# EAGLE design Board 0 (EAGLE 9.3.2)
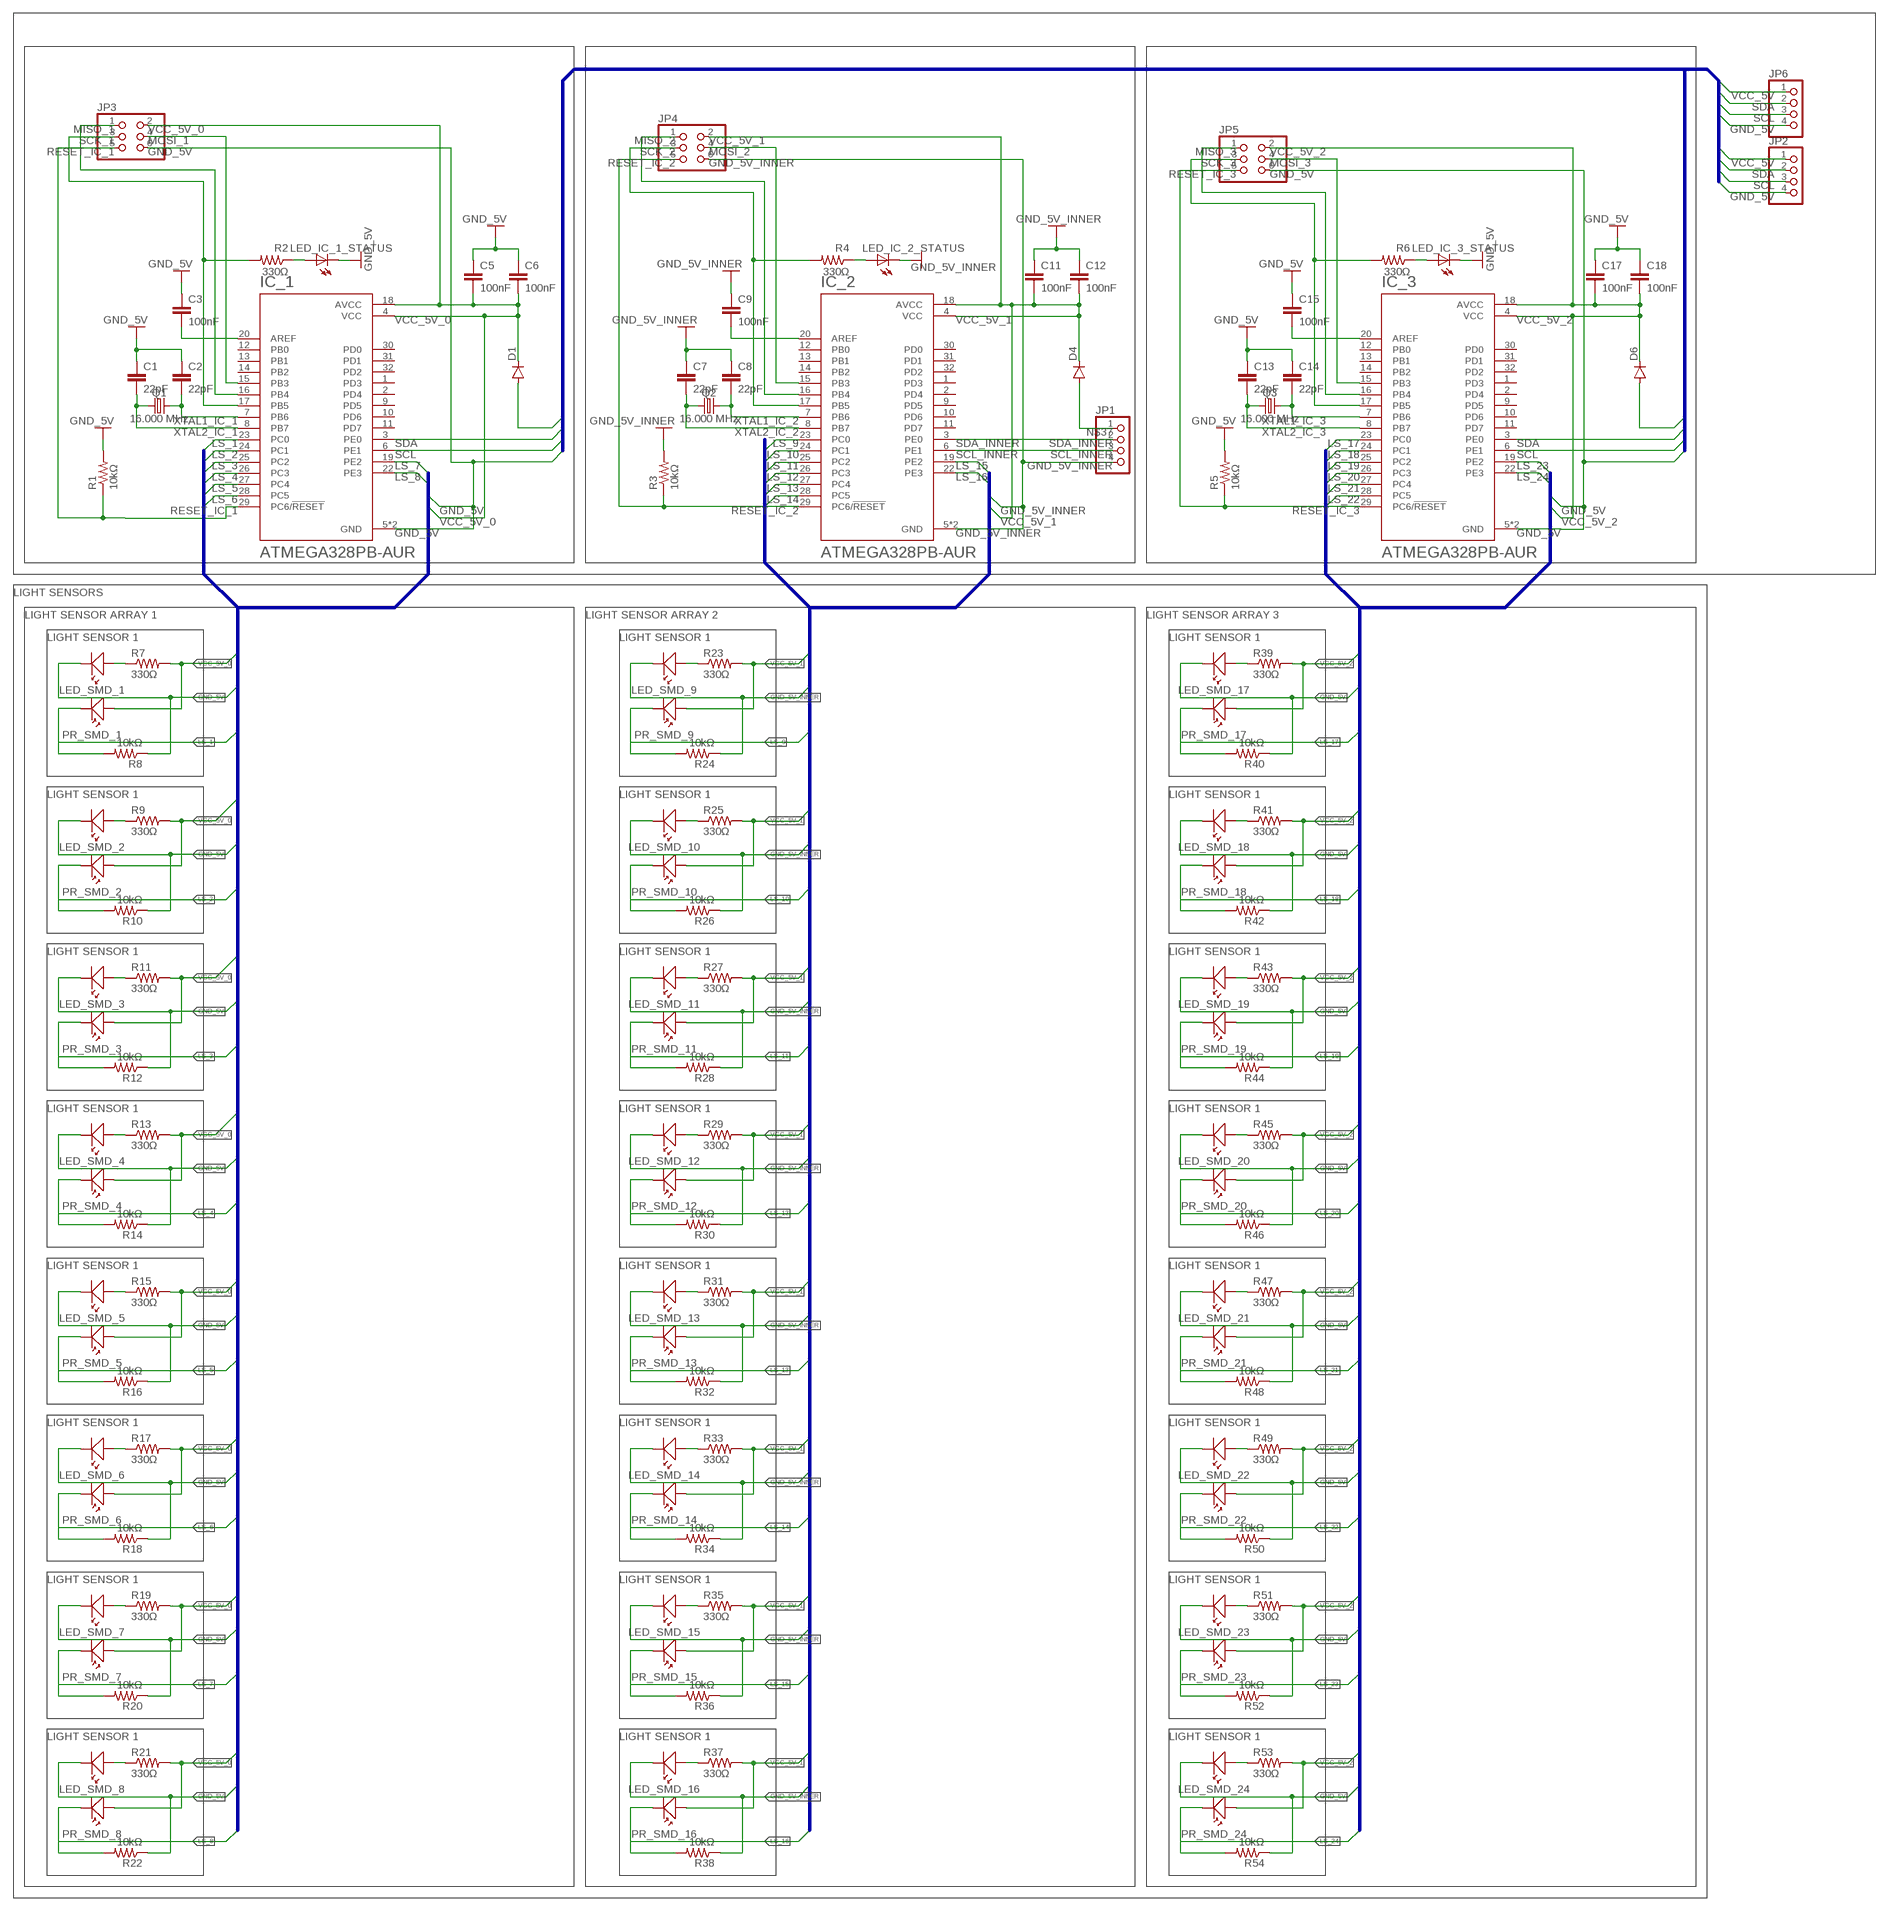
[diagram p0: schematic, sheet 1]

## Parts
C1  22pF  C-EUC1206  [C1206]
C2  22pF  C-EUC1206  [C1206]
C3  100nF  C-EUC1206  [C1206]
C5  100nF  C-EUC1206  [C1206]
C6  100nF  C-EUC1206  [C1206]
C7  22pF  C-EUC1206  [C1206]
C8  22pF  C-EUC1206  [C1206]
C9  100nF  C-EUC1206  [C1206]
C11  100nF  C-EUC1206  [C1206]
C12  100nF  C-EUC1206  [C1206]
C13  22pF  C-EUC1206  [C1206]
C14  22pF  C-EUC1206  [C1206]
C15  100nF  C-EUC1206  [C1206]
C17  100nF  C-EUC1206  [C1206]
C18  100nF  C-EUC1206  [C1206]
D1  DIODE-SOD123  [SOD123]
D4  DIODE-SOD123  [SOD123]
D6  DIODE-SOD123  [SOD123]
IC_1  ATMEGA328PB-AUR  [QFP80P900X900X120-32N]
IC_2  ATMEGA328PB-AUR  [QFP80P900X900X120-32N]
IC_3  ATMEGA328PB-AUR  [QFP80P900X900X120-32N]
JP1  PINHD-1X4_2.54-SMD  [1X04SMD]
JP2  PINHD-1X4_2.54-SMD  [1X04SMD]
JP3  PINHD-2X3_2.54-SMD  [2X03SMD]
JP4  PINHD-2X3_2.54-SMD  [2X03SMD]
JP5  PINHD-2X3_2.54-SMD  [2X03SMD]
JP6  PINHD-1X4_2.54-SMD  [1X04SMD]
LED_IC_1_STATUS  LEDP-LCC-2  [P-LCC-2]
LED_IC_2_STATUS  LEDP-LCC-2  [P-LCC-2]
LED_IC_3_STATUS  LEDP-LCC-2  [P-LCC-2]
LED_SMD_1  SMD_LED_3MM  [SMD_LED_3MM]
LED_SMD_2  SMD_LED_3MM  [SMD_LED_3MM]
LED_SMD_3  SMD_LED_3MM  [SMD_LED_3MM]
LED_SMD_4  SMD_LED_3MM  [SMD_LED_3MM]
LED_SMD_5  SMD_LED_3MM  [SMD_LED_3MM]
LED_SMD_6  SMD_LED_3MM  [SMD_LED_3MM]
LED_SMD_7  SMD_LED_3MM  [SMD_LED_3MM]
LED_SMD_8  SMD_LED_3MM  [SMD_LED_3MM]
LED_SMD_9  SMD_LED_3MM  [SMD_LED_3MM]
LED_SMD_10  SMD_LED_3MM  [SMD_LED_3MM]
LED_SMD_11  SMD_LED_3MM  [SMD_LED_3MM]
LED_SMD_12  SMD_LED_3MM  [SMD_LED_3MM]
LED_SMD_13  SMD_LED_3MM  [SMD_LED_3MM]
LED_SMD_14  SMD_LED_3MM  [SMD_LED_3MM]
LED_SMD_15  SMD_LED_3MM  [SMD_LED_3MM]
LED_SMD_16  SMD_LED_3MM  [SMD_LED_3MM]
LED_SMD_17  SMD_LED_3MM  [SMD_LED_3MM]
LED_SMD_18  SMD_LED_3MM  [SMD_LED_3MM]
LED_SMD_19  SMD_LED_3MM  [SMD_LED_3MM]
LED_SMD_20  SMD_LED_3MM  [SMD_LED_3MM]
LED_SMD_21  SMD_LED_3MM  [SMD_LED_3MM]
LED_SMD_22  SMD_LED_3MM  [SMD_LED_3MM]
LED_SMD_23  SMD_LED_3MM  [SMD_LED_3MM]
LED_SMD_24  SMD_LED_3MM  [SMD_LED_3MM]
PR_SMD_1  SMD_PHOTORESISTOR_5MM  [SMD_PHOTORESISTOR_5MM]
PR_SMD_2  SMD_PHOTORESISTOR_5MM  [SMD_PHOTORESISTOR_5MM]
PR_SMD_3  SMD_PHOTORESISTOR_5MM  [SMD_PHOTORESISTOR_5MM]
PR_SMD_4  SMD_PHOTORESISTOR_5MM  [SMD_PHOTORESISTOR_5MM]
PR_SMD_5  SMD_PHOTORESISTOR_5MM  [SMD_PHOTORESISTOR_5MM]
PR_SMD_6  SMD_PHOTORESISTOR_5MM  [SMD_PHOTORESISTOR_5MM]
PR_SMD_7  SMD_PHOTORESISTOR_5MM  [SMD_PHOTORESISTOR_5MM]
PR_SMD_8  SMD_PHOTORESISTOR_5MM  [SMD_PHOTORESISTOR_5MM]
PR_SMD_9  SMD_PHOTORESISTOR_5MM  [SMD_PHOTORESISTOR_5MM]
PR_SMD_10  SMD_PHOTORESISTOR_5MM  [SMD_PHOTORESISTOR_5MM]
PR_SMD_11  SMD_PHOTORESISTOR_5MM  [SMD_PHOTORESISTOR_5MM]
PR_SMD_12  SMD_PHOTORESISTOR_5MM  [SMD_PHOTORESISTOR_5MM]
PR_SMD_13  SMD_PHOTORESISTOR_5MM  [SMD_PHOTORESISTOR_5MM]
PR_SMD_14  SMD_PHOTORESISTOR_5MM  [SMD_PHOTORESISTOR_5MM]
PR_SMD_15  SMD_PHOTORESISTOR_5MM  [SMD_PHOTORESISTOR_5MM]
PR_SMD_16  SMD_PHOTORESISTOR_5MM  [SMD_PHOTORESISTOR_5MM]
PR_SMD_17  SMD_PHOTORESISTOR_5MM  [SMD_PHOTORESISTOR_5MM]
PR_SMD_18  SMD_PHOTORESISTOR_5MM  [SMD_PHOTORESISTOR_5MM]
PR_SMD_19  SMD_PHOTORESISTOR_5MM  [SMD_PHOTORESISTOR_5MM]
PR_SMD_20  SMD_PHOTORESISTOR_5MM  [SMD_PHOTORESISTOR_5MM]
PR_SMD_21  SMD_PHOTORESISTOR_5MM  [SMD_PHOTORESISTOR_5MM]
PR_SMD_22  SMD_PHOTORESISTOR_5MM  [SMD_PHOTORESISTOR_5MM]
PR_SMD_23  SMD_PHOTORESISTOR_5MM  [SMD_PHOTORESISTOR_5MM]
PR_SMD_24  SMD_PHOTORESISTOR_5MM  [SMD_PHOTORESISTOR_5MM]
Q1  16.000 MHz  CRYSTAL-16MHZSMD-5X3.2  [CRYSTAL-SMD-5X3.2-4PAD]
Q2  16.000 MHz  CRYSTAL-16MHZSMD-5X3.2  [CRYSTAL-SMD-5X3.2-4PAD]
Q3  16.000 MHz  CRYSTAL-16MHZSMD-5X3.2  [CRYSTAL-SMD-5X3.2-4PAD]
R1  10kΩ  R-US_R1206  [R1206]
R2  330Ω  R-US_R1206  [R1206]
R3  10kΩ  R-US_R1206  [R1206]
R4  330Ω  R-US_R1206  [R1206]
R5  10kΩ  R-US_R1206  [R1206]
R6  330Ω  R-US_R1206  [R1206]
R7  330Ω  R-US_R1206  [R1206]
R8  10kΩ  R-US_R1206  [R1206]
R9  330Ω  R-US_R1206  [R1206]
R10  10kΩ  R-US_R1206  [R1206]
R11  330Ω  R-US_R1206  [R1206]
R12  10kΩ  R-US_R1206  [R1206]
R13  330Ω  R-US_R1206  [R1206]
R14  10kΩ  R-US_R1206  [R1206]
R15  330Ω  R-US_R1206  [R1206]
R16  10kΩ  R-US_R1206  [R1206]
R17  330Ω  R-US_R1206  [R1206]
R18  10kΩ  R-US_R1206  [R1206]
R19  330Ω  R-US_R1206  [R1206]
R20  10kΩ  R-US_R1206  [R1206]
R21  330Ω  R-US_R1206  [R1206]
R22  10kΩ  R-US_R1206  [R1206]
R23  330Ω  R-US_R1206  [R1206]
R24  10kΩ  R-US_R1206  [R1206]
R25  330Ω  R-US_R1206  [R1206]
R26  10kΩ  R-US_R1206  [R1206]
R27  330Ω  R-US_R1206  [R1206]
R28  10kΩ  R-US_R1206  [R1206]
R29  330Ω  R-US_R1206  [R1206]
R30  10kΩ  R-US_R1206  [R1206]
R31  330Ω  R-US_R1206  [R1206]
R32  10kΩ  R-US_R1206  [R1206]
R33  330Ω  R-US_R1206  [R1206]
R34  10kΩ  R-US_R1206  [R1206]
R35  330Ω  R-US_R1206  [R1206]
R36  10kΩ  R-US_R1206  [R1206]
R37  330Ω  R-US_R1206  [R1206]
R38  10kΩ  R-US_R1206  [R1206]
R39  330Ω  R-US_R1206  [R1206]
R40  10kΩ  R-US_R1206  [R1206]
R41  330Ω  R-US_R1206  [R1206]
R42  10kΩ  R-US_R1206  [R1206]
R43  330Ω  R-US_R1206  [R1206]
R44  10kΩ  R-US_R1206  [R1206]
R45  330Ω  R-US_R1206  [R1206]
R46  10kΩ  R-US_R1206  [R1206]
R47  330Ω  R-US_R1206  [R1206]
R48  10kΩ  R-US_R1206  [R1206]
R49  330Ω  R-US_R1206  [R1206]
R50  10kΩ  R-US_R1206  [R1206]
R51  330Ω  R-US_R1206  [R1206]
R52  10kΩ  R-US_R1206  [R1206]
R53  330Ω  R-US_R1206  [R1206]
R54  10kΩ  R-US_R1206  [R1206]

## Nets
GND_5V [+5V Power]: C1.1 C2.1 C3.1 C5.1 C6.1 C13.1 C14.1 C15.1 C17.1 C18.1 IC_1.5(GND) IC_1.21(GND) IC_3.5(GND) IC_3.21(GND) JP2.4 JP3.6 JP5.6 JP6.4 LED_IC_1_STATUS.C LED_IC_3_STATUS.C LED_SMD_1.GND LED_SMD_2.GND LED_SMD_3.GND LED_SMD_4.GND LED_SMD_5.GND LED_SMD_6.GND LED_SMD_7.GND LED_SMD_8.GND LED_SMD_17.GND LED_SMD_18.GND LED_SMD_19.GND LED_SMD_20.GND LED_SMD_21.GND LED_SMD_22.GND LED_SMD_23.GND LED_SMD_24.GND R1.2 R5.2 R8.1 R10.1 R12.1 R14.1 R16.1 R18.1 R20.1 R22.1 R40.1 R42.1 R44.1 R46.1 R48.1 R50.1 R52.1 R54.1
GND_5V_INNER [+5V Power]: C7.1 C8.1 C9.1 C11.1 C12.1 IC_2.5(GND) IC_2.21(GND) JP1.4 JP4.6 LED_IC_2_STATUS.C LED_SMD_9.GND LED_SMD_10.GND LED_SMD_11.GND LED_SMD_12.GND LED_SMD_13.GND LED_SMD_14.GND LED_SMD_15.GND LED_SMD_16.GND R3.2 R24.1 R26.1 R28.1 R30.1 R32.1 R34.1 R36.1 R38.1
LS_1: IC_1.23(PC0) PR_SMD_1.GND R8.2
LS_2: IC_1.24(PC1) PR_SMD_2.GND R10.2
LS_3: IC_1.25(PC2) PR_SMD_3.GND R12.2
LS_4: IC_1.26(PC3) PR_SMD_4.GND R14.2
LS_5: IC_1.27(PC4) PR_SMD_5.GND R16.2
LS_6: IC_1.28(PC5) PR_SMD_6.GND R18.2
LS_7: IC_1.19(PE2) PR_SMD_7.GND R20.2
LS_8: IC_1.22(PE3) PR_SMD_8.GND R22.2
LS_9: IC_2.23(PC0) PR_SMD_9.GND R24.2
LS_10: IC_2.24(PC1) PR_SMD_10.GND R26.2
LS_11: IC_2.25(PC2) PR_SMD_11.GND R28.2
LS_12: IC_2.26(PC3) PR_SMD_12.GND R30.2
LS_13: IC_2.27(PC4) PR_SMD_13.GND R32.2
LS_14: IC_2.28(PC5) PR_SMD_14.GND R34.2
LS_15: IC_2.19(PE2) PR_SMD_15.GND R36.2
LS_16: IC_2.22(PE3) PR_SMD_16.GND R38.2
LS_17: IC_3.23(PC0) PR_SMD_17.GND R40.2
LS_18: IC_3.24(PC1) PR_SMD_18.GND R42.2
LS_19: IC_3.25(PC2) PR_SMD_19.GND R44.2
LS_20: IC_3.26(PC3) PR_SMD_20.GND R46.2
LS_21: IC_3.27(PC4) PR_SMD_21.GND R48.2
LS_22: IC_3.28(PC5) PR_SMD_22.GND R50.2
LS_23: IC_3.19(PE2) PR_SMD_23.GND R52.2
LS_24: IC_3.22(PE3) PR_SMD_24.GND R54.2
MISO_1: IC_1.16(PB4) JP3.1
MISO_2: IC_2.16(PB4) JP4.1
MISO_3: IC_3.16(PB4) JP5.1
MOSI_1: IC_1.15(PB3) JP3.4
MOSI_2: IC_2.15(PB3) JP4.4
MOSI_3: IC_3.15(PB3) JP5.4
N$1: C3.2 IC_1.20(AREF)
N$3: LED_IC_1_STATUS.A R2.1
N$4: LED_SMD_2.VIN R9.1
N$8: C9.2 IC_2.20(AREF)
N$9: LED_IC_2_STATUS.A R4.1
N$10: LED_SMD_3.VIN R11.1
N$11: LED_SMD_4.VIN R13.1
N$14: C15.2 IC_3.20(AREF)
N$15: LED_IC_3_STATUS.A R6.1
N$16: LED_SMD_1.VIN R7.1
N$17: LED_SMD_5.VIN R15.1
N$18: LED_SMD_6.VIN R17.1
N$19: LED_SMD_7.VIN R19.1
N$20: LED_SMD_8.VIN R21.1
N$21: LED_SMD_9.VIN R23.1
N$22: LED_SMD_10.VIN R25.1
N$23: LED_SMD_11.VIN R27.1
N$24: LED_SMD_12.VIN R29.1
N$25: LED_SMD_13.VIN R31.1
N$26: LED_SMD_14.VIN R33.1
N$27: LED_SMD_15.VIN R35.1
N$28: LED_SMD_16.VIN R37.1
N$29: LED_SMD_17.VIN R39.1
N$30: LED_SMD_18.VIN R41.1
N$31: LED_SMD_19.VIN R43.1
N$32: LED_SMD_20.VIN R45.1
N$33: LED_SMD_21.VIN R47.1
N$34: LED_SMD_22.VIN R49.1
N$35: LED_SMD_23.VIN R51.1
N$36: LED_SMD_24.VIN R53.1
N$37 [+5V Power]: D4.A JP1.1
RESET_IC_1: IC_1.29(PC6/!RESET) JP3.5 R1.1
RESET_IC_2: IC_2.29(PC6/!RESET) JP4.5 R3.1
RESET_IC_3: IC_3.29(PC6/!RESET) JP5.5 R5.1
SCK_1: IC_1.17(PB5) JP3.3 R2.2
SCK_2: IC_2.17(PB5) JP4.3 R4.2
SCK_3: IC_3.17(PB5) JP5.3 R6.2
SCL: IC_1.6(PE1) IC_3.6(PE1) JP2.3 JP6.3
SCL_INNER: IC_2.6(PE1) JP1.3
SDA: IC_1.3(PE0) IC_3.3(PE0) JP2.2 JP6.2
SDA_INNER: IC_2.3(PE0) JP1.2
VCC_5V [+5V Power]: D1.A D6.A JP2.1 JP6.1
VCC_5V_0 [+5V Power]: C5.2 C6.2 D1.C IC_1.4(VCC) IC_1.18(AVCC) JP3.2 PR_SMD_1.VIN PR_SMD_2.VIN PR_SMD_3.VIN PR_SMD_4.VIN PR_SMD_5.VIN PR_SMD_6.VIN PR_SMD_7.VIN PR_SMD_8.VIN R7.2 R9.2 R11.2 R13.2 R15.2 R17.2 R19.2 R21.2
VCC_5V_1 [+5V Power]: C11.2 C12.2 D4.C IC_2.4(VCC) IC_2.18(AVCC) JP4.2 PR_SMD_9.VIN PR_SMD_10.VIN PR_SMD_11.VIN PR_SMD_12.VIN PR_SMD_13.VIN PR_SMD_14.VIN PR_SMD_15.VIN PR_SMD_16.VIN R23.2 R25.2 R27.2 R29.2 R31.2 R33.2 R35.2 R37.2
VCC_5V_2 [+5V Power]: C17.2 C18.2 D6.C IC_3.4(VCC) IC_3.18(AVCC) JP5.2 PR_SMD_17.VIN PR_SMD_18.VIN PR_SMD_19.VIN PR_SMD_20.VIN PR_SMD_21.VIN PR_SMD_22.VIN PR_SMD_23.VIN PR_SMD_24.VIN R39.2 R41.2 R43.2 R45.2 R47.2 R49.2 R51.2 R53.2
XTAL1_IC_1: C2.2 IC_1.7(PB6) Q1.3
XTAL1_IC_2: C8.2 IC_2.7(PB6) Q2.3
XTAL1_IC_3: C14.2 IC_3.7(PB6) Q3.3
XTAL2_IC_1: C1.2 IC_1.8(PB7) Q1.1
XTAL2_IC_2: C7.2 IC_2.8(PB7) Q2.1
XTAL2_IC_3: C13.2 IC_3.8(PB7) Q3.1
Unconnected: IC_1.1(PD3) IC_1.2(PD4) IC_1.9(PD5) IC_1.10(PD6) IC_1.11(PD7) IC_1.12(PB0) IC_1.13(PB1) IC_1.14(PB2) IC_1.30(PD0) IC_1.31(PD1) IC_1.32(PD2) IC_2.1(PD3) IC_2.2(PD4) IC_2.9(PD5) IC_2.10(PD6) IC_2.11(PD7) IC_2.12(PB0) IC_2.13(PB1) IC_2.14(PB2) IC_2.30(PD0) IC_2.31(PD1) IC_2.32(PD2) IC_3.1(PD3) IC_3.2(PD4) IC_3.9(PD5) IC_3.10(PD6) IC_3.11(PD7) IC_3.12(PB0) IC_3.13(PB1) IC_3.14(PB2) IC_3.30(PD0) IC_3.31(PD1) IC_3.32(PD2)

## Buses
I2C_5V:GND_5V,SCL,SDA,VCC_5V
LIGHT_SESNOR_ARRAY_1:GND_5V,LS_[1..8],VCC_5V_0
LIGHT_SESNOR_ARRAY_2:GND_5V_INNER,LS_9,LS_10,LS_11,LS_12,LS_13,LS_14,LS_15,LS_16,VCC_5V_1
LIGHT_SESNOR_ARRAY_3:GND_5V,LS_[17..24],VCC_5V_2

## Notes on the sheet
- LIGHT SENSORS
- LIGHT SENSOR ARRAY 1 | LIGHT SENSOR ARRAY 2 | LIGHT SENSOR ARRAY 3
- LIGHT SENSOR 1 | LIGHT SENSOR 1 | LIGHT SENSOR 1
- LIGHT SENSOR 1 | LIGHT SENSOR 1 | LIGHT SENSOR 1
- LIGHT SENSOR 1 | LIGHT SENSOR 1 | LIGHT SENSOR 1
- LIGHT SENSOR 1 | LIGHT SENSOR 1 | LIGHT SENSOR 1
- LIGHT SENSOR 1 | LIGHT SENSOR 1 | LIGHT SENSOR 1
- LIGHT SENSOR 1 | LIGHT SENSOR 1 | LIGHT SENSOR 1
- LIGHT SENSOR 1 | LIGHT SENSOR 1 | LIGHT SENSOR 1
- LIGHT SENSOR 1 | LIGHT SENSOR 1 | LIGHT SENSOR 1

## Library data of the parts
C1-C3 C5-C9 C11-C15 C17 C18 = resistor:C-EU: CAPACITOR, European symbol
D1 D4 D6 = diode:DIODE-: DIODE
IC_1-IC_3 = ATMEGA328PB-AUR:ATMEGA328PB-AUR: ATmega Series 20 MHz 32 KB Flash 2 KB SRAM 8-Bit Microcontroller - TQFP-32; AVAILABILITY: Unavailable; DESCRIPTION: AVR microcontroller; EEPROM: 1024B; SRAM: 2kB; Flash: 32kB; TQFP32; MF: Microchip; MP: ATMEGA328PB-AUR; PACKAGE: TQFP-32 Microchip; PRICE: None
JP1 JP2 JP6 = pinhead-1:PINHD-1X4: PIN HEADER
JP3-JP5 = pinhead-1:PINHD-2X3: PIN HEADER
LED_IC_1_STATUS LED_IC_2_STATUS LED_IC_3_STATUS = adafruit:LED: LED OSRAM: - CHIPLED LG R971, LG N971, LY N971, LG Q971, LY Q971, LO R971, LY R971 LH N974, LH R974 LS Q976, LO Q976, LY Q976 LO Q996 - Hyper CHIPLED LW Q18S LB Q993, LB Q99A, LB R99A - SideLED LS A670, LO A670, LY A670, LG A670, LP A670 LB A673, LV A673, LT A673, LW A673 LH A674 LY A675 LS A676, LA A676, LO A676, LY A676, LW A676 LS A679, LY A679, LG A679 - Hyper Micro SIDELED® LS Y876, LA Y876, LO Y876, LY Y876 LT Y87S - SmartLED LW L88C, LW L88S LB L89C, LB L89S, LG L890 LS L89K, LO L89K, LY L89K LS L896, LA L896, LO L896, LY L896 - TOPLED LS T670, LO T670, LY T670, LG T670, LP T670 LSG T670, LSP T670, LSY T670, LOP T670, LYG T670 LG T671, LOG T671, LSG T671 LB T673, LV T673, LT T673, LW T673 LH T674 LS T676, LA T676, LO T676, LY T676, LB T676, LH T676, LSB T676, LW T676 LB T67C, LV T67C, LT T67C, LS T67K, LO T67K, LY T67K, LW E67C LS E67B, LA E67B, LO E67B, LY E67B, LB E67C, LV E67C, LT E67C LW T67C LS T679, LY T679, LG T679 LS T770, LO T770, LY T770, LG T770, LP T770 LB T773, LV T773, LT T773, LW T773 LH T774 LS E675, LA E675, LY E675, LS T675 LS T776, LA T776, LO T776, LY T776, LB T776 LHGB T686 LT T68C, LB T68C - Hyper Mini TOPLED® LB M676 - Mini TOPLED Santana® LG M470 LS M47K, LO M47K, LY M47K Source: http://www.osram.convergy.de/
LED_SMD_1-LED_SMD_24 = SMD:SMD_LED_3MM
PR_SMD_1-PR_SMD_24 = SMD:SMD_PHOTORESISTOR_5MM
Q1-Q3 = SparkFun-Clocks:CRYSTAL-16MHZ: 16MHz Crystal Digikey Example <http://www.digikey.com/product-search/en?keywords=535-9122-1-ND> Frequency: 16MHz Frequency Stability: ±50ppm Frequency Tolerance: ±20ppm Load Capacitance: 18pF SparkFun Products: Pro Micro -5V/16MHz <https://www.sparkfun.com/products/12640> SparkFun Serial Enabled LCD Kit <https://www.sparkfun.com/products/10097>; PROD_ID: XTAL-08218; SF_ID: COM-00094; VALUE: 16MHz
R1-R54 = resistor:R-US_: RESISTOR, American symbol

## Net classes
0 default: width 0.305 mm, clearance 0.152 mm
1 +12V Power: width 2.032 mm, drill 1.397 mm, clearance 0.305 mm
2 +5V Power: width 0.508 mm, drill 0.61 mm, clearance 0.203 mm

## Board
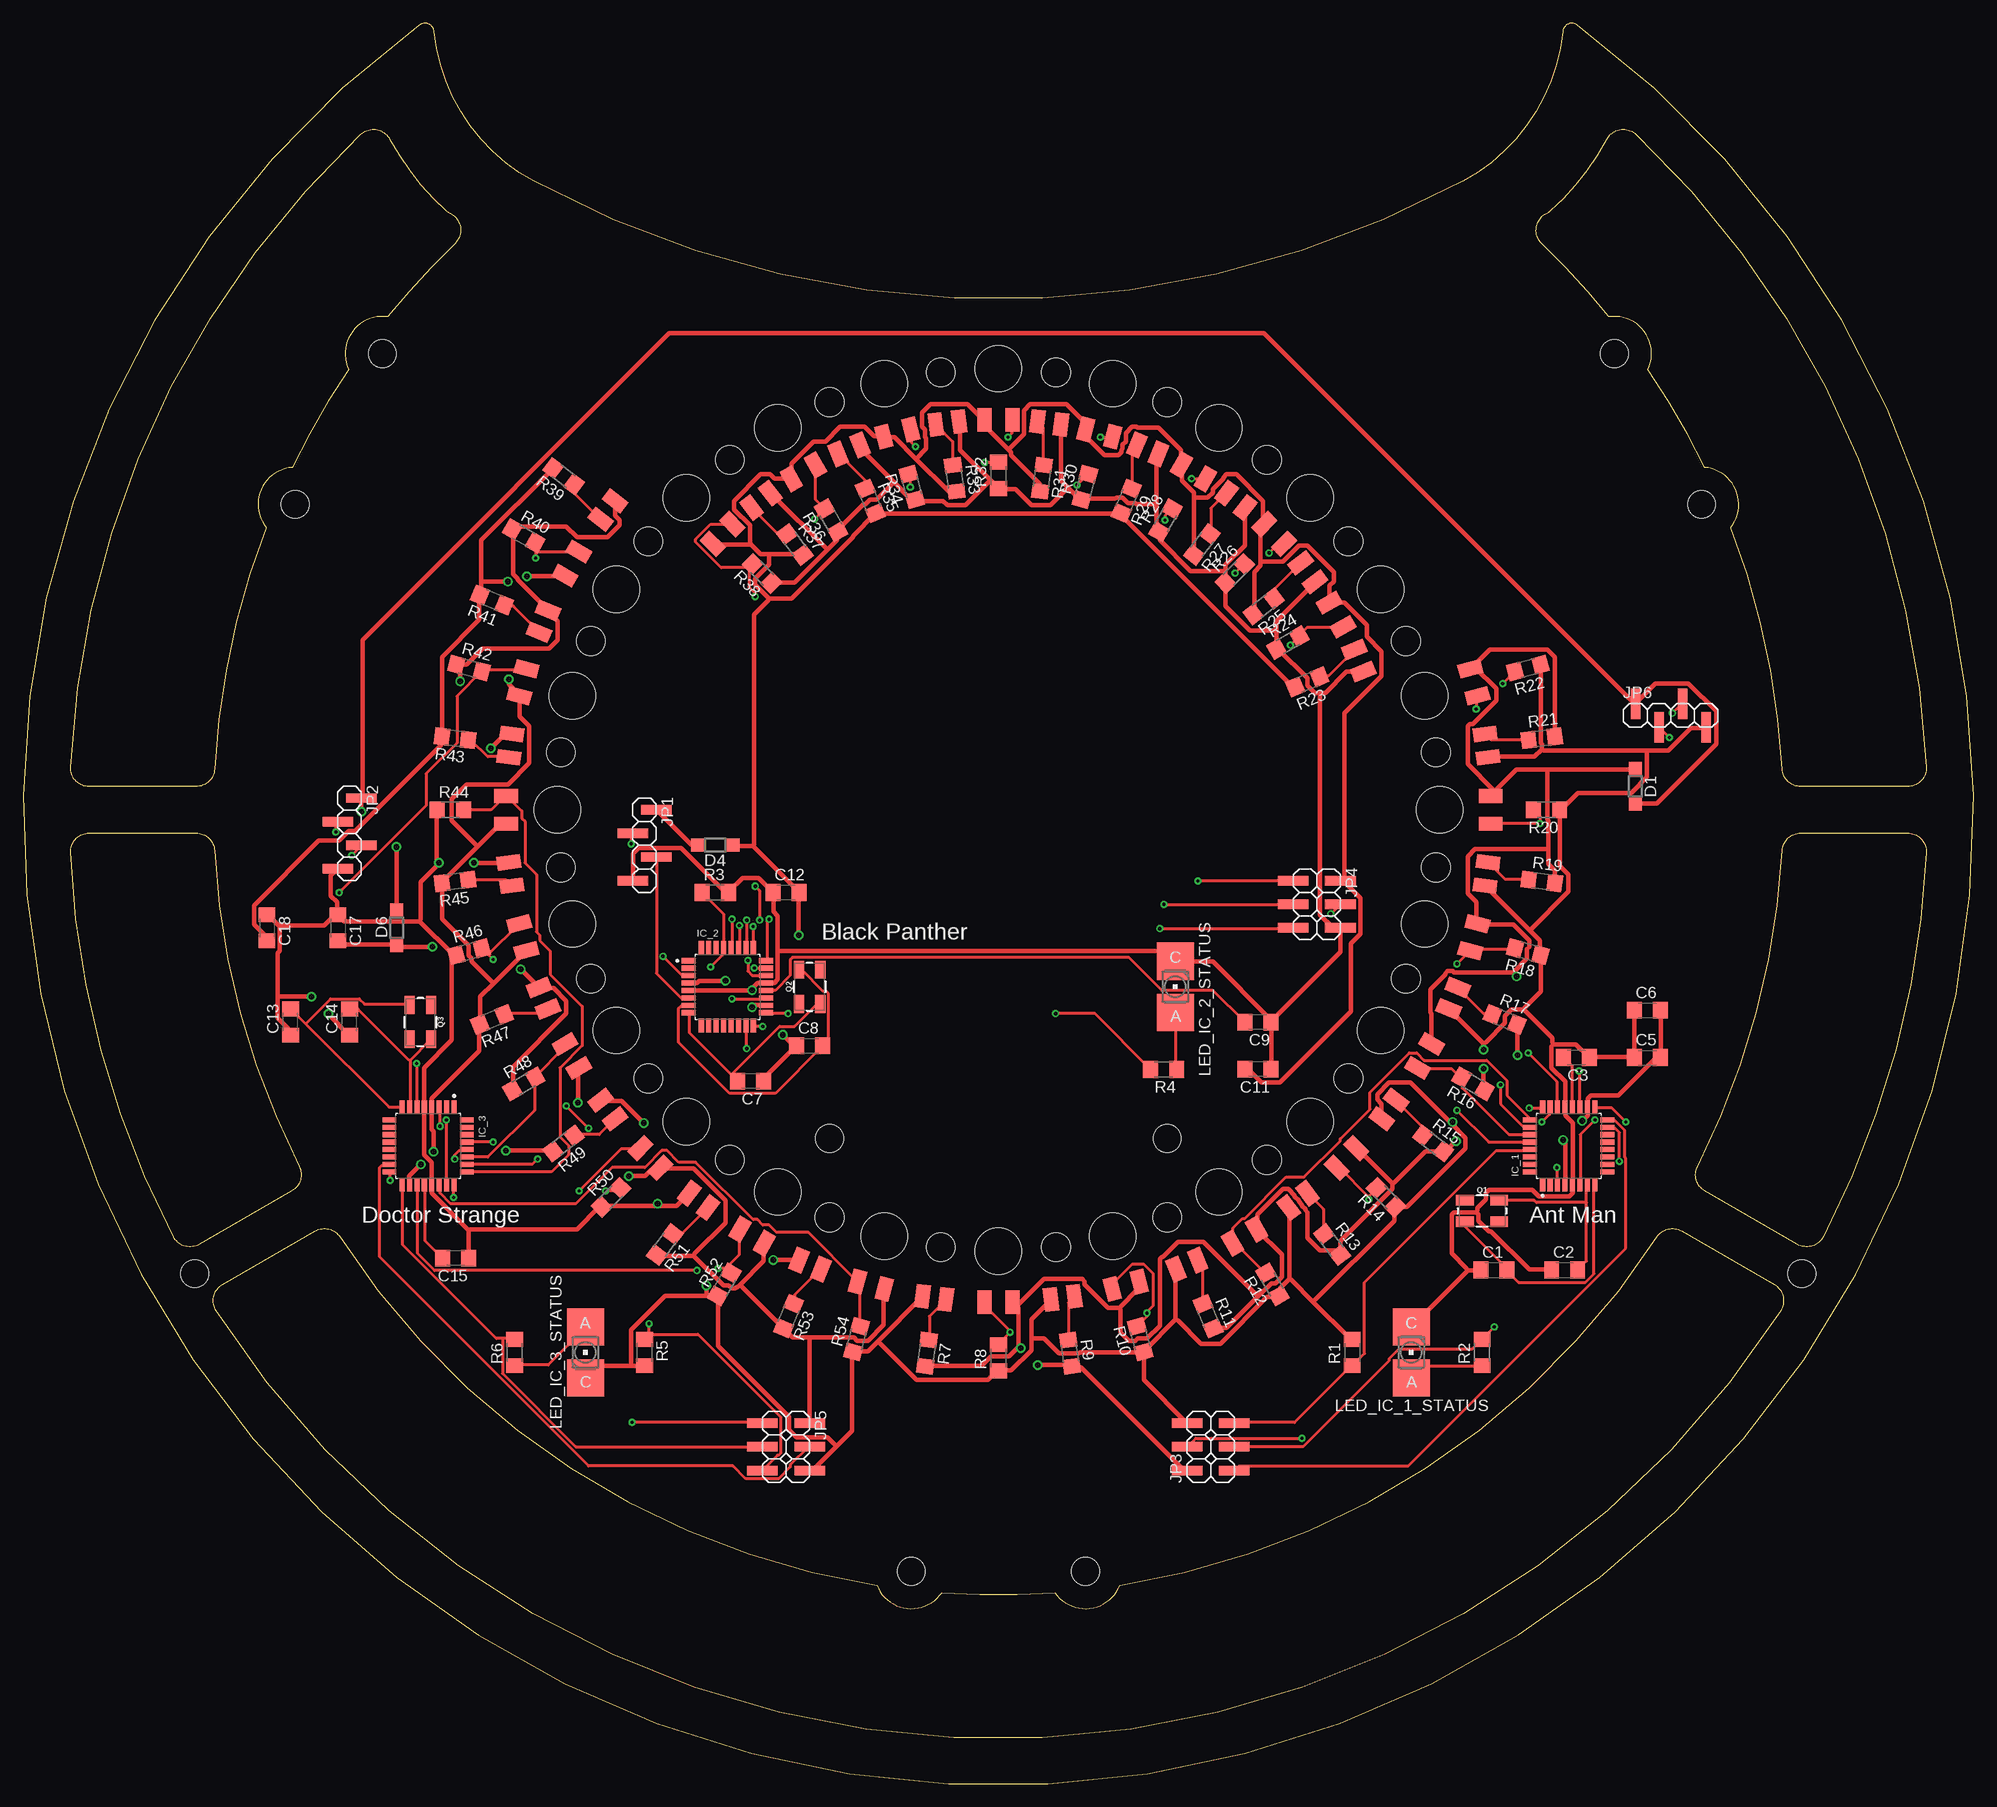
[diagram p1: board, top side]
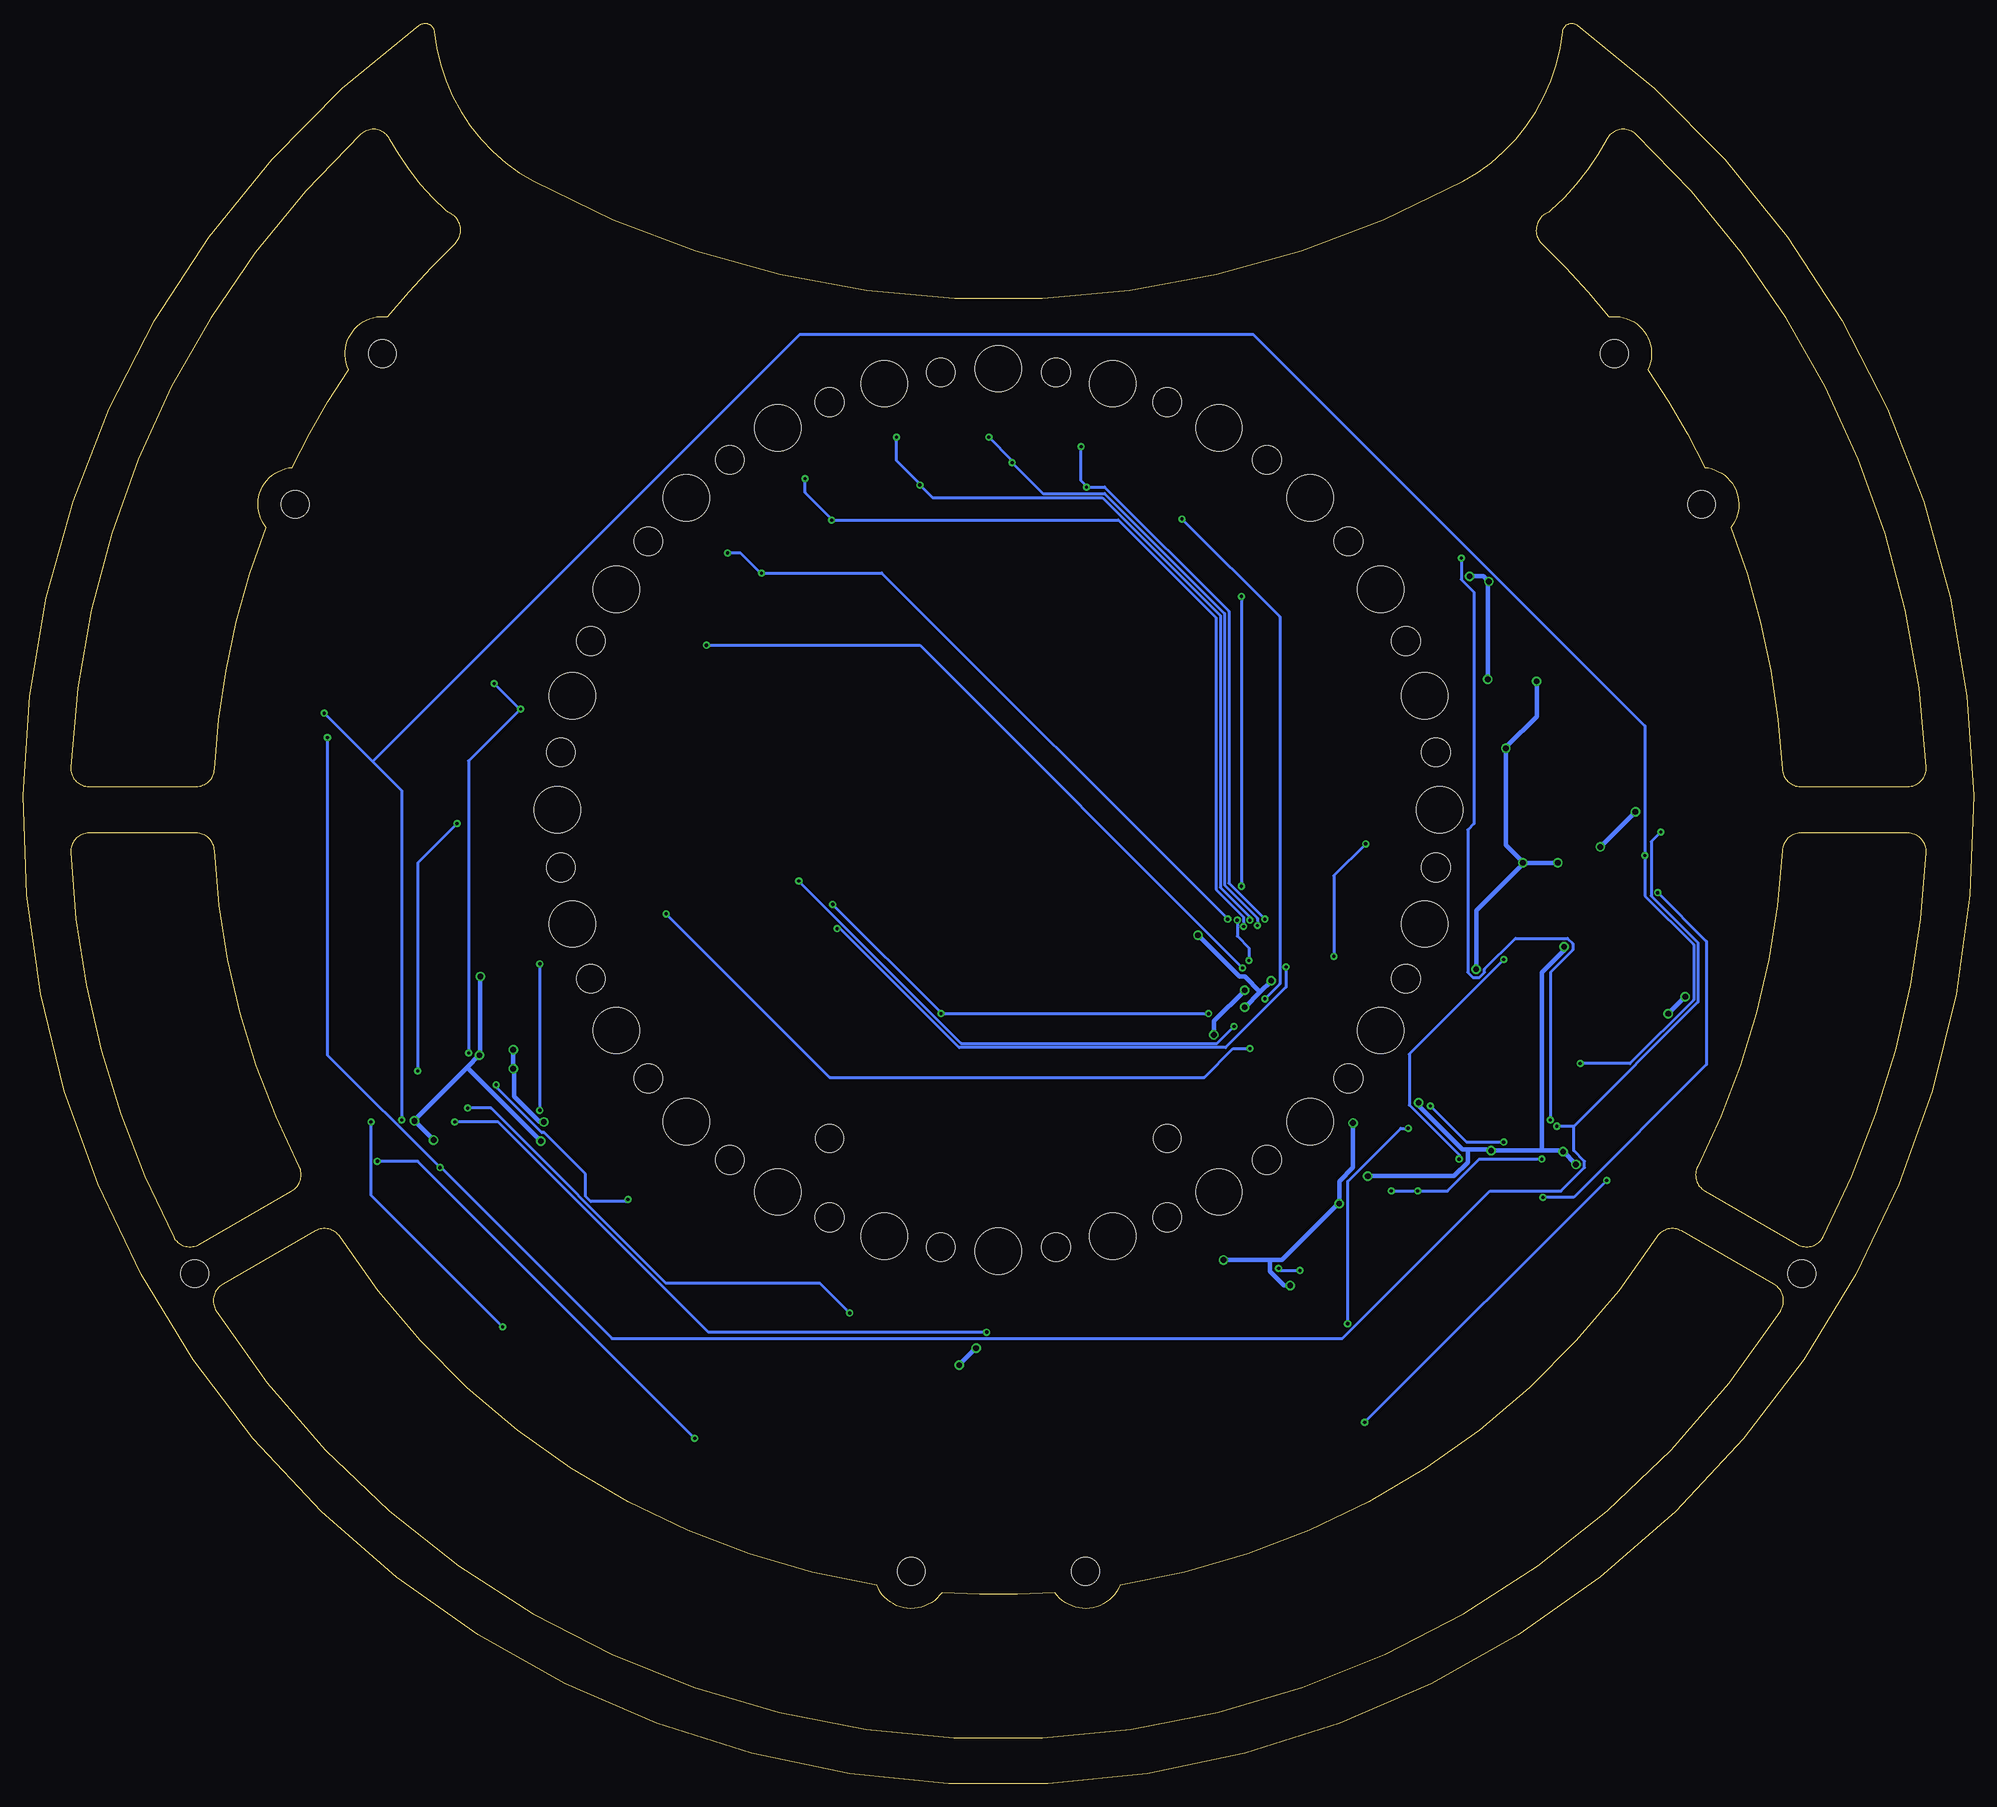
[diagram p2: board, bottom side, seen from below]

Size 209.97 x 189.54 mm. Coordinates in mm from the lower left corner, seen from the top.
Outline: 44.24,188.65 arc121 42.65,189.35 arc287 167.32,189.35 arc121 165.73,188.65 arc-56 154.99,172.53 arc-57 54.99,172.53 arc-56 44.24,188.65
Outline: 21.46,53.74 31.43,59.5 arc-87 34.1,58.86 arc48 91.9,21.38 arc124 98.9,20.58 arc8 111.08,20.58 arc124 118.08,21.38 arc48 175.87,58.86 arc-87 178.55,59.5 188.52,53.74 arc-93 189.2,50.93 arc-115 20.77,50.93 arc-93 21.46,53.74
Outline: 28.95,141.72 arc124 26.15,135.26 arc18 20.6,109.25 arc-87 18.6,107.36 7.09,107.36 arc-93 5.09,109.45 arc-44 36.34,177.57 arc-105 39.48,177.07 arc20 45.53,169.35 arc0 46.14,168.97 arc-105 46.48,165.83 arc7 39.24,157.93 arc124 35.04,152.27 arc8 28.95,141.72
Outline: 202.88,107.36 191.37,107.36 arc-87 189.37,109.25 arc18 183.83,135.26 arc124 181.02,141.72 arc8 174.93,152.27 arc124 170.74,157.93 arc7 163.49,165.83 arc-105 163.83,168.97 arc0 164.44,169.35 arc20 170.5,177.07 arc-105 173.63,177.57 arc-44 204.88,109.45 arc-93 202.88,107.36
Outline: 7.09,102.36 18.6,102.36 arc-87 20.6,100.46 arc24 29.71,66.47 arc-87 28.93,63.83 18.96,58.07 arc-93 16.18,58.89 arc-25 5.09,100.26 arc-93 7.09,102.36
Outline: 191.02,58.07 181.05,63.83 arc-87 180.26,66.47 arc24 189.37,100.46 arc-87 191.37,102.36 202.88,102.36 arc-93 204.88,100.26 arc-25 193.79,58.89 arc-93 191.02,58.07
Copper layers (1*16): Top 0.035mm / dielectric 1.5mm / Bottom 0.035mm
Design rules "default": minimum track width 6mil, minimum drill 0.35mm, track to track 6mil, track to pad 6mil, pad to pad 6mil, via to via 6mil, smd to smd 6mil, copper to edge 40mil, drill to drill 6mil, minimum pad ring 10mil, minimum via ring 8mil, stop-mask expansion 4mil, vias tented up to drill 0mil, thermal gap 10mil
Holes 3 mm at 29.28,137.74 38.66,153.98 171.31,153.98 180.69,137.74 191.5,54.91 18.48,54.91 95.61,22.86 114.36,22.86 86.81,69.47 123.16,69.47
Holes 3.1 mm at 57.89,111.06 61.1,123.03 67.3,133.77 76.07,142.54 86.81,148.74 98.79,151.95 98.79,57.76 86.81,60.97 76.07,67.17 67.3,75.94 61.1,86.68 57.89,98.66 152.08,98.66 148.87,86.68 142.67,75.94 133.9,67.17 123.16,60.97 111.19,57.76 111.19,151.95 123.16,148.74 133.9,142.54 142.67,133.77 148.87,123.03 152.08,111.06
Holes 5 mm at 57.49,104.86 59.1,117.15 63.85,128.61 71.4,138.44 81.24,145.99 92.69,150.74 104.99,57.36 92.69,58.98 81.24,63.72 71.4,71.27 63.85,81.11 59.1,92.56 152.49,104.86 150.87,92.56 146.12,81.11 138.57,71.27 128.74,63.72 117.28,58.98 104.99,152.36 117.28,150.74 128.74,145.99 138.57,138.44 146.12,128.61 150.87,117.15

### Footprints (pad centres in the part's own frame; a part is rotated, then mirrored left to right if it is on the bottom)
C1206 = smd 1.6 x 1.8: 1 -1.4,0; 2 1.4,0
SOD123 = smd 1.4 x 1.4: A 1.9,0; C -1.9,0
QFP80P900X900X120-32N = smd 1.47 x 0.55: 1 -4.17,2.8; 2 -4.17,2; 3 -4.17,1.2; 4 -4.17,0.4; 5 -4.17,-0.4; 6 -4.17,-1.2; 7 -4.17,-2; 8 -4.17,-2.8; 17 4.17,-2.8; 18 4.17,-2; 19 4.17,-1.2; 20 4.17,-0.4; 21 4.17,0.4; 22 4.17,1.2; 23 4.17,2; 24 4.17,2.8 | smd 0.55 x 1.47: 9 -2.8,-4.17; 10 -2,-4.17; 11 -1.2,-4.17; 12 -0.4,-4.17; 13 0.4,-4.17; 14 1.2,-4.17; 15 2,-4.17; 16 2.8,-4.17; 25 2.8,4.17; 26 2,4.17; 27 1.2,4.17; 28 0.4,4.17; 29 -0.4,4.17; 30 -1.2,4.17; 31 -2,4.17; 32 -2.8,4.17
1X04SMD = smd 1.016 x 3.302: 1 -1.27,1.27; 2 1.27,-1.27; 3 3.81,1.27; 4 6.35,-1.27
2X03SMD = smd 1.016 x 3.302: 1 -1.27,-3.81; 2 -1.27,1.27; 3 1.27,-3.81; 4 1.27,1.27; 5 3.81,-3.81; 6 3.81,1.27
P-LCC-2 = smd 4 x 4: A 0,2.75; C 0,-2.75
SMD_LED_3MM = smd 2.54 x 1.5: GND 0,-1.27; VIN 0,1.27
SMD_PHOTORESISTOR_5MM = smd 2.54 x 1.5: GND 0,-1.5; VIN 0,1.5
CRYSTAL-SMD-5X3.2-4PAD = smd 1.9 x 1.1: 1 -1.85,-1.15; 2 1.85,-1.15; 3 1.85,1.15; 4 -1.85,1.15
R1206 = smd 1.6 x 1.803: 1 -1.422,0; 2 1.422,0

### Placement (x,y rotation side)
C1  158.33,55.33 0 top
C2  165.95,55.33 0 top
C3  167.22,78.19 180 top
C5  174.84,78.19 0 top
C6  174.84,83.27 0 top
C7  78.32,75.65 180 top
C8  84.67,79.46 0 top
C9  132.93,82 180 top
C11  132.93,76.92 180 top
C12  82.13,95.97 0 top
C13  28.79,82 90 top
C14  35.14,82 90 top
C15  46.57,56.6 180 top
C17  33.87,92.16 270 top
C18  26.25,92.16 270 top
D1  173.57,107.4 270 top
D4  74.51,101.05 180 top
D6  40.22,92.16 90 top
IC_1  166.38,68.68 90 top
IC_2  75.81,85.81 0 top
IC_3  43.59,68.68 270 top
JP1  66.89,103.59 270 top
JP2  35.14,104.86 270 top
JP3  126.58,35.01 90 top
JP4  140.55,95.97 270 top
JP5  83.4,37.55 270 top
JP6  174.84,115.02 0 top
LED_IC_1_STATUS  149.44,46.44 180 top
LED_IC_2_STATUS  124.04,85.81 180 top
LED_IC_3_STATUS  60.54,46.44 0 top
LED_SMD_1  98.07,52.31 262.5 top
LED_SMD_2  111.9,52.31 277.5 top
LED_SMD_3  125.27,55.89 292.5 top
LED_SMD_4  137.25,62.81 307.5 top
LED_SMD_5  147.03,72.59 322.5 top
LED_SMD_6  153.95,84.57 337.5 top
LED_SMD_7  157.53,97.94 352.5 top
LED_SMD_8  157.53,111.77 7.5 top
LED_SMD_9  143.79,120.93 22.5 top
LED_SMD_10  138.31,130.42 37.5 top
LED_SMD_11  130.55,138.18 52.5 top
LED_SMD_12  121.06,143.66 67.5 top
LED_SMD_13  110.47,146.5 82.5 top
LED_SMD_14  99.5,146.5 97.5 top
LED_SMD_15  88.91,143.66 112.5 top
LED_SMD_16  79.42,138.18 127.5 top
LED_SMD_17  62.94,137.12 142.5 top
LED_SMD_18  56.02,125.14 157.5 top
LED_SMD_19  52.44,111.77 172.5 top
LED_SMD_20  52.44,97.94 187.5 top
LED_SMD_21  56.02,84.57 202.5 top
LED_SMD_22  62.94,72.59 217.5 top
LED_SMD_23  72.72,62.81 232.5 top
LED_SMD_24  84.7,55.89 247.5 top
PR_SMD_1  104.99,51.86 270 top
PR_SMD_2  118.7,53.66 285 top
PR_SMD_3  131.49,58.96 300 top
PR_SMD_4  142.46,67.38 315 top
PR_SMD_5  150.89,78.36 330 top
PR_SMD_6  156.18,91.14 345 top
PR_SMD_7  157.99,104.86 0 top
PR_SMD_8  156.18,118.57 15 top
PR_SMD_9  141.36,125.86 30 top
PR_SMD_10  134.68,134.56 45 top
PR_SMD_11  125.99,141.23 60 top
PR_SMD_12  115.86,145.43 75 top
PR_SMD_13  104.99,146.86 90 top
PR_SMD_14  94.12,145.43 105 top
PR_SMD_15  83.99,141.23 120 top
PR_SMD_16  75.29,134.56 135 top
PR_SMD_17  59.09,131.36 150 top
PR_SMD_18  53.79,118.57 165 top
PR_SMD_19  51.99,104.86 180 top
PR_SMD_20  53.79,91.14 195 top
PR_SMD_21  59.09,78.36 210 top
PR_SMD_22  67.51,67.38 225 top
PR_SMD_23  78.49,58.96 240 top
PR_SMD_24  91.27,53.66 255 top
Q1  157.06,61.68 0 top
Q2  84.67,85.81 90 top
Q3  42.76,82 270 top
R1  143.09,46.44 90 top
R2  157.06,46.44 90 top
R3  74.51,95.97 0 top
R4  122.77,76.92 180 top
R5  66.89,46.44 270 top
R6  52.92,46.44 90 top
R7  97.29,46.36 262.5 top
R8  104.99,45.86 90 top
R9  112.69,46.36 277.5 top
R10  120.26,47.87 105 top
R11  127.56,50.35 292.5 top
R12  134.49,53.76 120 top
R13  140.9,58.05 307.5 top
R14  146.71,63.14 135 top
R15  151.79,68.94 322.5 top
R16  156.08,75.36 150 top
R17  159.5,82.28 337.5 top
R18  161.98,89.59 165 top
R19  163.48,97.16 352.5 top
R20  163.99,104.86 180 top
R21  163.48,112.56 7.5 top
R22  161.98,120.13 195 top
R23  138.25,118.63 202.5 top
R24  136.16,122.86 30 top
R25  133.55,126.77 217.5 top
R26  130.44,130.31 45 top
R27  126.9,133.42 232.5 top
R28  122.99,136.03 60 top
R29  118.76,138.12 247.5 top
R30  114.3,139.63 75 top
R31  109.69,140.55 262.5 top
R32  104.99,140.86 90 top
R33  100.29,140.55 277.5 top
R34  95.67,139.63 105 top
R35  91.21,138.12 292.5 top
R36  86.99,136.03 120 top
R37  83.07,133.42 307.5 top
R38  79.53,130.31 135 top
R39  58.18,140.77 142.5 top
R40  53.89,134.36 330 top
R41  50.48,127.44 157.5 top
R42  48,120.13 345 top
R43  46.49,112.56 172.5 top
R44  45.99,104.86 0 top
R45  46.49,97.16 187.5 top
R46  48,89.59 15 top
R47  50.48,82.28 202.5 top
R48  53.89,75.36 30 top
R49  58.18,68.94 217.5 top
R50  63.27,63.14 45 top
R51  69.07,58.05 232.5 top
R52  75.49,53.76 60 top
R53  82.41,50.35 247.5 top
R54  89.72,47.87 75 top

### Tracks (layer width: path | path; a pad name or v marks a point on that pad's centre or on a via)
GND_5V  (via drill 0.61)
  Top 0.508: 65.44,44.96 61.9,44.96 60.64,43.71 LED_IC_3_STATUS.C | 65.44,44.96 66.81,44.96 R5.2 | 73.55,52.51 69.1,52.51 65.44,48.85 65.44,44.96 | 73.55,52.51 74.7,52.51 R52.1 74.81,52.28 74.81,47.14 82.47,39.48 82.47,38.11 83.27,37.31 86.58,37.31 87.56,36.33 | 47.95,59.59 47.95,56.62 C15.1 | 47.95,59.59 43.95,63.59 43.95,64.28 IC_3.21 43.95,64.51 43.95,66.91 43.15,67.71 43.15,72.74 IC_3.5 43.15,73.08 43.15,77.08 46.12,80.05 46.12,89.08 R46.1 46.58,89.31 46.24,89.31 42.69,92.85 | 68.3,62.22 70.35,62.22 71.61,63.48 LED_SMD_23.GND | 68.3,62.22 62.35,62.22 R50.1 62.01,62.11 59.61,59.71 48.18,59.71 47.95,59.59 | v66.81,71.14 64.41,73.54 62.24,73.54 LED_SMD_22.GND | v68.3,62.45 68.3,62.22 | v80.75,56.39 83.5,56.39 LED_SMD_24.GND | v73.55,53.65 73.55,52.51 | LED_SMD_17.GND 63.72,136.52 64.18,136.06 64.18,135.49 62.92,134.23 59.61,134.23 58.47,135.37 53.21,135.37 52.98,135.15 R40.1 52.75,135.03 52.75,130.23 53.21,129.77 53.21,129.66 56.41,126.46 LED_SMD_18.GND 56.52,126.23 57.55,125.2 57.55,123.14 56.64,122.23 49.44,122.23 47.72,120.52 46.69,120.52 R42.1 47.04,120.29 v47.04,118.69 | 27.38,84.74 27.38,89.43 27.61,89.65 27.61,92.28 | 27.38,84.74 27.38,82.45 28.75,81.08 28.75,80.62 C13.1 | 27.61,92.28 26.35,93.54 C18.1 | v32.86,82.91 32.86,82.8 35.03,80.62 C14.1 | 27.38,84.74 v31.03,84.74 | R48.1 52.75,74.68 52.75,77.2 58.47,82.91 58.47,84.28 57.09,85.65 55.61,85.65 LED_SMD_21.GND 55.38,85.88 v53.55,87.71 | C17.1 33.78,93.66 33.78,94.91 33.09,95.6 33.09,97.77 33.78,98.46 JP2.4 | 42.69,92.85 34.58,92.85 34.01,93.43 C17.1 | 44.52,99.14 44.52,98.8 42.81,97.08 42.81,93.08 42.69,92.85
  Top 0.508: 44.52,99.14 44.52,104.86 R44.1 | v48.52,99.14 52.18,99.14 LED_SMD_20.GND | v44.75,99.14 44.52,99.14 | v50.35,111.49 51.84,112.97 52.52,112.97 LED_SMD_19.GND | 27.61,92.28 27.83,92.4 32.41,92.4 33.55,93.54 C17.1 | 163.51,111.37 163.51,111.94 163.39,112.06 163.39,120.4 R22.1 | 163.51,111.37 162.71,110.57 157.79,110.57 LED_SMD_8.GND | 174.82,111.26 163.74,111.26 163.51,111.37 | 174.82,111.26 177.11,111.26 179.51,113.66 181.11,113.66 JP6.4 | 155.51,55.25 156.88,55.25 C1.1 | 155.51,55.25 149.45,49.19 LED_IC_1_STATUS.C | 156.42,61.54 156.65,61.31 156.65,60.62 157.79,59.48 158.02,59.48 162.14,55.36 164.54,55.36 C2.1 | 156.42,61.54 154.02,61.54 153.79,61.31 153.79,57.08 155.39,55.48 155.51,55.25 | 162.19,91.88 157.45,96.63 LED_SMD_7.GND | 162.19,91.88 163.28,90.8 163.28,89.31 R18.1 163.39,88.97 163.39,85.31 161.68,83.6 161.56,83.37 | 162.19,91.88 166.37,96.06 166.37,97.88 165.45,98.8 165.45,104.86 R20.1 165.68,104.97 167.39,106.69 173.11,106.69 174.82,108.4 174.82,111.26 | v157.22,76.97 157.22,74.68 R16.1 | 157.22,79.71 v157.22,79.02 | 157.22,79.71 153.56,83.37 LED_SMD_6.GND | C6.1 173.45,83.25 173.45,78.45 C5.1 173.34,78.22 168.65,78.22 C3.1 168.42,78.34 167.17,79.6 164.77,79.6 | 164.77,79.6 164.54,79.37 164.54,77.08 166.02,75.6 166.02,73.08 IC_1.21 166.02,72.74 166.02,71.94 166.82,71.14 166.82,64.51 IC_1.5 166.82,64.28 166.82,63.59 166.48,63.25 163.17,63.25 162.48,63.94 157.79,63.94 157.45,63.59 157.45,62.91 156.54,61.99 156.54,61.77 156.42,61.54 | 161.56,83.37 160.19,83.37 159.51,82.68 159.51,81.88 157.45,79.82 157.22,79.71 | 161.56,83.37 164.65,80.28 164.65,79.82 164.77,79.6
  Top 0.508: 136.3,54.34 135.28,53.31 135.28,52.62 R12.1 135.05,52.39 133.9,52.39 128.88,47.36 126.82,47.36 124.3,49.88 124.07,49.99 | 136.3,54.34 136.3,61.99 LED_SMD_4.GND | 138.88,51.88 136.53,54.22 136.3,54.34 | 138.88,51.88 142.82,47.94 143.05,47.94 R1.2 | 138.88,51.88 147.62,60.62 147.62,62.11 R14.1 147.96,62.11 148.99,62.11 155.28,68.39 155.28,69.54 153.74,71.08 | 153.74,71.08 149.33,75.48 147.05,75.48 145.79,74.22 145.79,73.65 146.25,73.2 LED_SMD_5.GND | 92.01,47.65 96.76,52.39 LED_SMD_1.GND | 92.01,47.65 90.93,46.56 89.44,46.56 R54.1 89.21,46.33 89.21,37.99 87.56,36.33 | 87.56,36.33 84.98,33.76 84.76,33.76 JP5.6 | 108.53,47.94 108.53,49.99 110.59,52.05 LED_SMD_2.GND | 108.53,47.94 108.53,46.68 106.36,44.51 104.99,44.51 R8.1 104.76,44.39 103.84,43.48 96.19,43.48 92.01,47.65 | JP3.6 120.65,43.48 120.65,46.45 R10.1 | 124.07,49.99 124.07,55.36 LED_SMD_3.GND | 124.07,49.99 120.76,46.68 R10.1 | 108.53,47.94 109.9,47.94 111.5,46.33 113.67,46.33 113.79,46.45 120.42,46.45 R10.1 | v153.91,71.25 153.74,71.08
  Bottom 0.508: v66.81,71.14 66.81,66.34 68.3,64.85 v68.3,62.45 68.52,62.34 74.47,56.39 75.73,56.39 | 75.73,56.39 v80.75,56.39 | v73.55,53.65 74.24,53.65 75.73,55.14 75.73,56.39 | v31.03,84.74 v32.86,82.91 | v44.75,99.14 v48.52,99.14 | v48.52,99.14 48.64,99.37 50.35,101.08 v50.35,111.49 50.24,111.71 47.04,114.91 v47.04,118.69 | v53.55,87.71 53.55,94 48.64,98.91 v48.52,99.14 | v157.22,79.02 v157.22,76.97 157.11,76.74 157.11,74 154.36,71.25 v153.91,71.25
GND_5V_INNER  (via drill 0.61)
  Top 0.508: JP1.4 65.67,97.31 65.67,100.17 66.24,100.74 70.81,100.74 75.38,96.17 75.73,96.17 R3.2 75.95,96.06 77.44,97.54 79.15,97.54 80.64,96.06 C12.1 80.75,95.71 80.75,93.88 81.21,93.43 81.21,89.65 | C7.1 79.73,75.71 79.73,75.94 83.16,79.37 C8.1 82.93,79.48 v81.78,80.62 | 78.24,85.43 71.73,85.43 IC_2.5 | 78.24,85.43 79.04,86.23 79.95,86.23 IC_2.21 80.18,86.23 80.87,86.23 81.21,86.57 81.21,89.65 | v78.47,85.43 78.24,85.43 | C11.1 134.36,76.97 134.36,82 C9.1 | C9.1 134.48,82.23 141.79,89.54 141.79,92.05 JP4.6 141.56,92.17 140.99,92.17 139.62,93.54 139.62,117.43 | C9.1 134.25,82.34 128.08,88.51 124.07,88.51 LED_IC_2_STATUS.C 123.85,88.63 122.82,89.65 81.21,89.65 | 134.93,124.17 134.93,125.2 139.05,129.32 LED_SMD_10.GND | 134.93,124.17 134.93,122.23 R24.1 135.16,122.12 138.25,119.03 138.25,118.23 139.05,117.43 139.62,117.43 | 134.93,124.17 132.08,124.17 129.45,126.8 129.45,129.2 R26.1 129.45,129.55 129.45,130.57 | 139.62,117.43 140.19,117.43 142.48,119.72 144.19,119.72 LED_SMD_9.GND | 129.45,130.57 129.45,131.26 131.5,133.32 131.5,137.32 LED_SMD_11.GND | 93.73,140.12 90.13,143.72 90.13,144.06 LED_SMD_15.GND | 93.73,140.12 95.5,138.35 95.96,138.35 R34.1 96.19,138.12 99.04,138.12 99.5,137.66 101.44,137.66 104.13,140.35 | 86.58,132.86 87.61,133.89 87.61,134.69 R36.1 87.73,135.03 90.47,137.77 90.7,137.77 91.16,138.23 91.84,138.23 93.73,140.12 | 86.58,132.86 83.04,129.32 80.64,129.32 R38.1 | 86.58,132.86 80.53,138.92 LED_SMD_16.GND | 104.13,140.35 100.87,143.6 100.87,146.58 LED_SMD_14.GND | 104.13,140.35 104.99,139.49 R32.1 105.22,139.38 106.82,139.38 108.53,137.66 110.59,137.66 112.47,139.55
  Top 0.508: 122.02,137.77 122.02,143.03 122.13,143.15 LED_SMD_12.GND | 122.02,137.77 122.02,135.72 122.25,135.49 122.25,134.8 R28.1 122.36,134.57 122.36,133.89 125.67,130.57 129.45,130.57 | 122.02,137.77 119.85,137.77 119.73,137.89 118.93,137.89 118.36,138.46 117.67,138.46 117.56,138.35 114.02,138.35 R30.1 113.79,138.23 112.47,139.55 | 112.47,139.55 111.73,140.29 111.73,146.23 LED_SMD_13.GND
  Bottom 0.508: v81.78,80.62 81.78,82.11 v78.47,85.43
LS_1  (via drill 0.35)
  Top 0.305: v163.51,71.25 164.31,72.05 164.31,72.74 IC_1.23 | R8.2 104.99,47.36 v106.24,48.62 106.24,48.74 103.5,51.48 103.5,51.82 PR_SMD_1.GND
  Bottom 0.305: v163.51,71.25 158.82,71.25 136.19,48.62 v106.24,48.62
LS_2  (via drill 0.35)
  Top 0.305: v162.14,72.74 163.51,72.74 IC_1.24 | R10.2 119.96,49.31 120.99,50.34 v120.99,50.68 120.99,50.79 121.67,51.48 121.67,54.91 120.65,55.94 119.39,55.94 117.33,53.88 117.33,53.31 PR_SMD_2.GND
  Bottom 0.305: v162.14,72.74 159.62,72.74 140.76,53.88 124.19,53.88 v120.99,50.68
LS_3
  Top 0.305: IC_1.25 162.14,71.48 162.14,71.71 159.74,74.11 159.74,75.71 157.56,77.88 150.82,77.88 150.02,78.68 149.22,78.68 144.99,74.45 144.99,72.62 141.79,69.42 141.79,69.19 137.9,65.31 135.96,65.31 131.5,60.85 131.28,60.85 130.25,59.82 130.25,58.22 PR_SMD_3.GND 130.36,58.34 133.68,55.02 R12.2
LS_4  (via drill 0.35)
  Top 0.305: v159.05,75.25 159.05,73.2 161.56,70.68 162.14,70.68 IC_1.26 | R14.2 145.68,64.05 144.88,63.25 v144.88,62.91 144.76,63.25 141.79,66.22 141.45,66.22 PR_SMD_4.GND
  Bottom 0.305: v159.05,75.25 159.05,75.02 154.14,70.11 153.91,70.11 149.45,65.65 149.45,63.25 148.88,62.68 145.11,62.68 v144.88,62.91
LS_5
  Top 0.305: IC_1.27 162.14,69.88 159.96,69.88 154.94,74.91 154.94,76.05 R16.2 154.71,76.05 153.79,76.97 150.25,76.97 PR_SMD_5.GND
LS_6  (via drill 0.35)
  Top 0.305: v154.36,72.51 157.79,69.08 162.14,69.08 IC_1.28 | v154.36,88.28 155.74,89.65 PR_SMD_6.GND 155.85,89.77 155.96,89.88 160.54,89.88 R18.2
  Bottom 0.305: v154.36,88.28 v154.36,72.51
LS_7  (via drill 0.35)
  Top 0.305: v167.51,76.74 167.51,72.85 IC_1.19 | R20.2 162.59,104.86 163.28,104.17 v163.28,103.37 158.02,103.37 PR_SMD_7.GND
  Bottom 0.305: v167.51,76.74 167.51,99.14 v163.28,103.37
LS_8  (via drill 0.35)
  Top 0.305: v162.02,78.68 165.11,75.6 165.11,72.85 IC_1.22 | v156.42,115.71 156.42,116.97 156.54,117.09 PR_SMD_8.GND | v159.28,118.46 160.54,119.72 R22.2
  Bottom 0.305: v162.02,78.68 162.02,110.11 v156.42,115.71 156.54,115.71 v159.28,118.46
LS_9  (via drill 0.35)
  Top 0.305: v78.7,87.83 79.95,87.83 IC_2.23 | v136.42,122.57 137.33,123.49 R24.2 137.45,123.72 138.25,124.52 142.02,124.52 PR_SMD_9.GND
  Bottom 0.305: v78.7,87.83 113.44,122.57 v136.42,122.57
LS_10  (via drill 0.35)
  Top 0.305: v80.3,93.08 80.07,92.85 80.07,88.63 IC_2.24 | R26.2 v130.48,130.35 | v134.13,132.52 135.05,133.43 135.73,133.43 PR_SMD_10.GND
  Bottom 0.305: v80.3,93.08 117.56,130.35 v130.48,130.35 130.59,130.35 132.76,132.52 v134.13,132.52
LS_11  (via drill 0.35)
  Top 0.305: v78.58,92.28 78.58,90 IC_2.25 | v122.93,136.06 122.93,136.52 123.62,137.2 R28.2 | v125.79,140.52 127.27,140.52 PR_SMD_11.GND
  Bottom 0.305: v78.58,92.28 78.58,93.31 81.56,96.28 81.56,125.54 92.07,136.06 v122.93,136.06 122.93,136.17 125.79,139.03 v125.79,140.52
LS_12  (via drill 0.35)
  Top 0.305: v77.9,92.97 77.9,90 IC_2.26 | v113.44,139.83 114.59,140.98 R30.2 | v115.96,144.98 117.22,144.98 PR_SMD_12.GND
  Bottom 0.305: v77.9,92.97 77.9,93.31 81.1,96.51 81.1,125.77 93.79,138.46 112.07,138.46 v113.44,139.83 113.44,139.95 115.96,142.46 v115.96,144.98
LS_13  (via drill 0.35)
  Top 0.305: v77.1,92.4 77.1,90 IC_2.27 | v103.5,142.23 104.99,142.23 R32.2 | v106.02,144.98 106.47,145.43 106.47,146.8 PR_SMD_13.GND
  Bottom 0.305: v77.1,92.4 77.1,93.2 80.64,96.74 80.64,126 93.56,138.92 100.19,138.92 v103.5,142.23 103.5,142.46 v106.02,144.98
LS_14  (via drill 0.35)
  Top 0.305: v76.3,93.08 76.3,90 IC_2.28 | v95.5,139.6 95.5,140.86 95.39,140.98 R34.2 | v96.07,143.95 95.61,144.4 95.61,145.78 PR_SMD_14.GND
  Bottom 0.305: v76.3,93.08 80.18,96.97 80.18,126.23 93.56,139.6 v95.5,139.6 95.5,139.72 96.07,140.29 v96.07,143.95
LS_15  (via drill 0.35)
  Top 0.305: v76.3,84.51 79.95,84.51 IC_2.19 | v85.21,136.17 86.24,137.2 R36.2 86.24,137.32 85.33,138.23 85.33,141.89 PR_SMD_15.GND
  Bottom 0.305: v76.3,84.51 74.7,86.11 74.7,125.66 v85.21,136.17
LS_16  (via drill 0.35)
  Top 0.305: v78.01,88.63 78.01,87.48 78.47,87.03 79.95,87.03 IC_2.22 | v79.27,92.97 79.27,96.17 v78.81,96.63 | v78.81,127.83 78.81,128.17 78.13,128.86 78.13,130.92 78.47,131.26 R38.2 78.01,130.92 75.15,130.92 72.41,133.66 72.41,134 74.01,135.6 76.3,135.6 PR_SMD_16.GND
  Bottom 0.305: v78.01,88.63 78.01,90 79.27,91.25 v79.27,92.97 | v78.81,127.83 v78.81,96.63
LS_17  (via drill 0.35)
  Top 0.305: v45.55,71.48 45.55,64.51 IC_3.23 | v55.15,131.95 55.15,133.55 R40.2 55.27,132.63 59.72,132.63 PR_SMD_17.GND
  Bottom 0.305: v45.55,71.48 45.55,87.37 43.15,89.77 43.15,90.45 43.72,91.03 49.32,91.03 52.64,87.71 52.64,87.37 53.21,86.8 53.89,86.8 54.47,87.37 54.47,102.68 53.78,103.37 53.78,128.29 55.15,129.66 v55.15,131.95
LS_18  (via drill 0.35)
  Top 0.305: v46.35,63.14 46.35,64.39 IC_3.24 | v34.01,95.94 43.38,105.31 43.38,108.74 46.69,112.06 46.69,117.09 49.32,119.72 R42.2 49.44,119.83 49.55,119.94 54.12,119.94 PR_SMD_18.GND
  Bottom 0.305: v46.35,63.14 43.04,63.14 28.75,77.42 28.75,90.68 v34.01,95.94
LS_19
  Top 0.305: IC_3.25 47.84,65.88 56.87,65.88 58.7,67.71 58.7,68.74 57.78,69.65 57.78,77.08 60.18,79.48 60.18,83.71 56.75,87.14 56.75,89.65 55.61,90.8 55.61,91.37 55.27,91.71 55.27,97.88 54.01,99.14 54.01,103.6 53.67,103.94 53.67,104.74 52.07,106.34 PR_SMD_19.GND 51.84,106.34 50.35,104.86 R44.2
LS_20  (via drill 0.35)
  Top 0.305: v55.38,67.25 54.81,66.68 47.84,66.68 IC_3.26 | v50.58,88.74 49.44,89.88 R46.2 50.12,89.31 53.32,92.51 PR_SMD_20.GND
  Bottom 0.305: v55.38,67.25 55.38,67.71 60.75,73.08 60.75,78.57 v50.58,88.74
LS_21
  Top 0.305: IC_3.27 47.84,67.48 50.01,67.48 55.04,72.51 55.04,76.05 R48.2 55.15,76.17 58.24,79.25 58.24,79.6 PR_SMD_21.GND
LS_22  (via drill 0.35)
  Top 0.305: v46.46,67.25 46.46,67.71 46.92,68.17 47.72,68.17 IC_3.28 | v62.7,63.82 63.95,63.82 R50.2 | v59.84,63.82 64.41,68.39 66.35,68.39 PR_SMD_22.GND
  Bottom 0.305: v46.46,67.25 53.21,67.25 56.64,63.82 v59.84,63.82 v62.7,63.82
LS_23  (via drill 0.35)
  Top 0.305: v72.53,55.25 44.29,55.25 42.46,57.08 42.46,64.39 IC_3.19 | v74.81,55.48 75.73,55.48 76.18,55.02 R52.2 75.73,55.59 77.1,56.96 77.1,59.59 PR_SMD_23.GND
  Bottom 0.305: v72.53,55.25 74.58,55.25 v74.81,55.48
LS_24
  Top 0.305: IC_3.22 44.86,64.39 44.86,63.59 46.01,62.45 59.5,62.45 63.38,66.34 66.92,66.34 68.75,68.17 69.32,68.17 70.58,66.91 72.41,66.91 78.58,60.74 79.04,60.74 79.61,60.17 80.3,60.17 81.1,59.37 84.53,59.37 89.78,54.11 PR_SMD_24.GND 89.9,53.99 90.01,53.88 90.01,49.31 R54.2
MISO_1
  Top 0.305: IC_1.16 170.59,71.37 171.39,71.37 172.42,70.34 172.42,67.48 172.54,67.37 172.54,57.65 149.11,34.22 130.93,34.22 130.48,33.76 JP3.1
MISO_2  (via drill 0.35)
  Top 0.305: v79.61,81.54 78.7,81.54 IC_2.16 | v126.47,97.2 136.65,97.2 JP4.1
  Bottom 0.305: v79.61,81.54 81.44,79.71 108.99,79.71 v126.47,97.2
MISO_3  (via drill 0.35)
  Top 0.305: v39.49,64.97 39.49,65.77 IC_3.16 | v65.55,38.91 79.5,38.91 JP5.1
  Bottom 0.305: v65.55,38.91 v39.49,64.97
MOSI_1  (via drill 0.35)
  Top 0.305: v171.85,67.02 171.85,70.11 171.39,70.57 170.59,70.57 IC_1.15 | v137.68,37.19 126.25,37.19 125.33,36.28 JP3.4
  Bottom 0.305: v171.85,67.02 167.51,67.02 v137.68,37.19
MOSI_2  (via drill 0.35)
  Top 0.305: v77.9,79.14 77.9,81.54 IC_2.15 | v140.76,93.66 141.79,94.68 JP4.4
  Bottom 0.305: v77.9,79.14 79.73,79.14 82.81,76.05 123.16,76.05 v140.76,93.66
MOSI_3
  Top 0.305: JP5.4 84.53,36.28 82.58,34.33 82.58,34.1 81.33,32.85 77.78,32.85 76.41,34.22 60.87,34.22 38.35,56.74 38.35,66.34 38.58,66.57 39.38,66.57 IC_3.15
N$1
  Top 0.305: IC_1.20 166.71,72.85 166.71,77.31 165.91,78.11 C3.2
N$3
  Top 0.305: R2.1 156.99,44.96 150.71,44.96 149.45,43.71 LED_IC_1_STATUS.A
N$4
  Top 0.305: R9.1 112.53,47.82 112.53,51.82 113.1,52.39 LED_SMD_2.VIN
N$8
  Top 0.305: IC_2.20 80.07,85.43 80.98,85.43 82.58,87.03 82.58,88.74 82.81,88.97 119.05,88.97 122.59,85.43 128.08,85.43 131.5,82 C9.2
N$9
  Top 0.305: R4.1 124.07,76.97 124.07,83.03 LED_IC_2_STATUS.A
N$10
  Top 0.305: R11.1 126.93,51.71 126.93,55.82 126.47,56.28 LED_SMD_3.VIN
N$11
  Top 0.305: R13.1 139.96,59.25 139.96,61.88 138.36,63.48 LED_SMD_4.VIN
N$14
  Top 0.305: IC_3.20 43.26,64.39 43.26,58.45 45.09,56.62 C15.2
N$15
  Top 0.305: R6.1 52.98,45.08 56.52,45.08 60.52,49.08 LED_IC_3_STATUS.A
N$16
  Top 0.305: R7.1 97.56,47.82 97.56,50.34 99.27,52.05 LED_SMD_1.VIN
N$17
  Top 0.305: R15.1 150.59,69.88 150.59,70.8 147.85,73.54 LED_SMD_5.VIN
N$18
  Top 0.305: R17.1 158.14,82.91 157.22,82.91 154.48,85.65 LED_SMD_6.VIN
N$19
  Top 0.305: R19.1 162.02,97.43 159.51,97.43 157.79,99.14 LED_SMD_7.VIN
N$20
  Top 0.305: R21.1 162.02,112.4 158.02,112.4 157.45,112.97 LED_SMD_8.VIN
N$21
  Top 0.305: R23.1 139.62,119.26 140.53,119.26 143.28,122 LED_SMD_9.VIN
N$22
  Top 0.305: R25.1 134.7,127.72 134.7,128.63 137.45,131.37 LED_SMD_10.VIN
N$23
  Top 0.305: R27.1 127.85,134.57 127.85,137.32 129.45,138.92 LED_SMD_11.VIN
N$24
  Top 0.305: R29.1 119.39,139.49 119.39,143.6 119.85,144.06 LED_SMD_12.VIN
N$25
  Top 0.305: R31.1 109.79,142 109.79,146 109.22,146.58 LED_SMD_13.VIN
N$26
  Top 0.305: R33.1 100.07,142 100.07,144.52 98.36,146.23 LED_SMD_14.VIN
N$27
  Top 0.305: R35.1 90.58,139.49 90.58,140.4 87.84,143.15 LED_SMD_15.VIN
N$28
  Top 0.305: R37.1 82.13,134.57 81.21,134.57 78.47,137.32 LED_SMD_16.VIN
N$29
  Top 0.305: R39.1 59.38,139.83 59.38,138.92 62.12,136.17 LED_SMD_17.VIN
N$30
  Top 0.305: R41.1 51.84,126.8 52.75,126.8 55.49,124.06 LED_SMD_18.VIN
N$31
  Top 0.305: R43.1 47.95,112.29 48.29,112.29 50.01,110.57 52.18,110.57 LED_SMD_19.VIN
N$32
  Top 0.305: R45.1 47.95,97.31 51.95,97.31 52.52,96.74 LED_SMD_20.VIN
N$33
  Top 0.305: R47.1 51.84,82.91 55.95,82.91 56.41,83.37 LED_SMD_21.VIN
N$34
  Top 0.305: R49.1 59.38,69.88 62.01,69.88 63.61,71.48 LED_SMD_22.VIN
N$35
  Top 0.305: R51.1 70.01,59.25 70.93,59.25 73.67,61.99 LED_SMD_23.VIN
N$36
  Top 0.305: R53.1 83.04,51.71 83.04,52.62 85.78,55.36 LED_SMD_24.VIN
N$37
  Top 0.508: D4.A 72.53,101.08 71.95,101.08 68.18,104.86 JP1.1
RESET_IC_1
  Top 0.305: IC_1.29 162.14,68.17 158.59,68.17 144.42,53.99 144.42,46.33 143.16,45.08 R1.1 142.93,44.96 136.88,38.91 130.48,38.91 JP3.5
RESET_IC_2  (via drill 0.35)
  Top 0.305: R3.1 73.1,95.94 75.38,93.66 75.38,90 IC_2.29 75.38,89.88 75.38,89.31 v74.01,87.94 | v122.36,92.05 136.65,92.05 JP4.5
  Bottom 0.305: v122.36,92.05 122.02,92.05 109.22,79.25 80.53,79.25 74.01,85.77 v74.01,87.94
RESET_IC_3  (via drill 0.35)
  Top 0.305: v50.58,69.08 47.84,69.08 IC_3.29 | v60.87,70.57 v58.47,72.97 | v67.38,49.54 67.38,48.39 66.92,47.94 R5.1 67.5,48.39 72.64,48.39 81.56,39.48 81.56,35.59 81.33,35.36 81.21,35.36 JP5.5
  Bottom 0.305: v50.58,69.08 54.58,69.08 v58.47,72.97 | v60.87,70.57 61.67,70.57 67.38,64.85 v67.38,49.54
SCK_1  (via drill 0.35)
  Top 0.305: v172.54,71.25 171.05,72.74 169.22,72.74 IC_1.17 | v158.36,49.19 157.11,47.94 R2.2 156.99,47.82 155.96,46.79 148.08,46.79 147.05,45.76 147.05,45.53 137.79,36.28 JP3.3
  Bottom 0.305: v172.54,71.25 172.54,63.37 v158.36,49.19
SCK_2  (via drill 0.35)
  Top 0.305: v82.36,82.91 80.07,82.91 IC_2.17 | v111.16,82.91 115.39,82.91 121.33,76.97 R4.2 | v122.82,94.68 136.65,94.68 JP4.3
  Bottom 0.305: v82.36,82.91 v111.16,82.91 111.16,83.03 v122.82,94.68
SCK_3
  Top 0.305: 51.61,47.94 52.87,47.94 R6.2 | 51.61,47.94 50.92,47.94 40.86,57.99 40.86,64.39 IC_3.17 | JP5.3 59.5,36.28 51.61,44.16 51.61,47.94
SCL  (via drill 0.35)
  Top 0.305: v42.35,77.54 42.35,72.85 IC_3.6 | v35.38,99.94 36.41,100.97 JP2.3 | v169.22,71.48 167.62,69.88 167.62,64.51 IC_1.6 | v177.57,115.26 178.6,116.29 JP6.3
  Bottom 0.305: v42.35,77.54 36.98,77.54 30.12,84.4 30.12,90.34 35.38,95.6 v35.38,99.94 35.38,113.89 77.55,156.06 126.36,156.06 172.37,110.06 | v169.22,71.48 169.22,106.91 172.37,110.06 | v177.57,115.26 172.37,110.06
SCL_INNER
  Top 0.305: IC_2.6 71.61,84.63 70.81,84.63 68.18,87.25 68.18,99.71 JP1.3
SDA  (via drill 0.35)
  Top 0.305: v44.86,70.8 44.86,72.74 IC_3.3 | v33.66,102.46 33.66,103.37 33.78,103.48 JP2.2 | v165.11,66.34 165.11,64.51 IC_1.3 | JP6.2 v177.22,112.63
  Bottom 0.305: 43.04,70.8 v44.86,70.8 | 43.04,70.8 29.66,84.17 29.66,90.57 34.69,95.6 34.69,101.43 v33.66,102.46 | v177.22,112.63 177.22,78.45 v165.11,66.34 164.99,66.34 146.59,47.94 67.95,47.94 52.07,63.82 44.41,63.82 41.89,66.34 41.89,67.02 43.04,68.17 43.04,70.8
SDA_INNER  (via drill 0.35)
  Top 0.305: v68.87,89.08 70.93,87.03 71.61,87.03 IC_2.3 | v65.44,101.2 65.44,102.11 65.55,102.23 JP1.2
  Bottom 0.305: v68.87,89.08 68.87,97.77 v65.44,101.2
VCC_5V  (via drill 0.61)
  Top 0.508: v40.18,100.86 40.18,94.11 D6.A | v36.41,104.63 JP2.1 36.52,106.34 36.52,123.14 69.55,156.18 133.56,156.18 173.34,116.4 JP6.1 175.74,118.46 179.28,118.46 182.25,115.49 182.25,111.94 175.85,105.54 173.57,105.54 D1.A
  Bottom 0.508: v36.41,104.63 v40.18,100.86
VCC_5V_0  (via drill 0.61)
  Top 0.508: C6.2 176.31,83.25 176.31,78.22 C5.2 176.08,78 175.62,78 171.74,74.11 168.77,74.11 168.42,73.77 168.42,73.08 IC_1.18 168.42,72.74 168.42,71.94 v167.85,71.37 | v165.79,69.31 166.02,69.08 166.02,64.51 IC_1.4 | v160.88,78.45 160.88,81.65 R17.2 | 160.42,87.37 154.02,87.37 153.91,87.48 153.34,87.48 153.11,87.25 153.11,87.14 151.51,85.54 151.51,83.03 151.62,82.91 151.62,79.71 PR_SMD_5.VIN | 160.42,87.37 161.91,88.85 161.91,89.88 162.14,90.11 162.14,90.8 160.42,92.51 156.65,92.51 PR_SMD_6.VIN 156.42,92.74 156.42,94.91 155.51,95.83 155.51,99.83 156.31,100.63 164.19,100.63 | R21.2 164.88,112.74 164.88,121.32 164.08,122.12 157.91,122.12 155.85,120.06 PR_SMD_8.VIN 156.31,120.17 158.59,117.89 158.59,116.63 156.08,114.11 155.74,114.11 155.51,113.89 155.51,109.77 158.25,107.03 PR_SMD_7.VIN 158.02,106.46 160.76,109.2 164.08,109.2 | 164.08,109.2 173.57,109.2 D1.C | 164.19,100.63 164.19,103.71 164.08,103.83 164.08,109.2 | 164.19,100.63 164.19,99.03 164.88,98.34 164.88,97.08 R19.2 | v160.76,86.91 160.54,87.14 160.42,87.37 | 132.93,52.45 134.36,53.88 134.82,53.88 135.5,54.56 135.5,56.96 132.88,59.59 PR_SMD_3.VIN 132.88,59.94 132.88,61.31 135.62,64.05 136.19,64.05 136.88,63.37 136.88,63.25 137.33,62.79 137.33,62.68 137.68,62.34 137.68,62.22 138.02,61.88 138.02,61.77 138.25,61.54 138.25,58.79 139.62,57.42 141.56,57.42 R13.2 141.79,56.96 141.79,58.45 147.39,64.05 147.39,64.62 | 132.93,52.45 129.56,49.08 128.19,49.08 R11.2 | 147.39,64.62 143.62,68.39 PR_SMD_4.VIN | 147.39,64.62 147.62,64.74 150.94,68.05 152.88,68.05 R15.2 153.11,68.05 v154.25,69.19
  Top 0.508: JP3.2 125.22,33.76 124.99,33.76 113.9,44.85 112.87,44.85 R9.2 112.64,45.08 v109.22,45.08 | 107.16,47.02 106.13,45.99 104.19,45.99 103.16,44.96 97.21,44.96 R7.2 | 107.16,47.02 107.16,51.25 106.59,51.82 PR_SMD_1.VIN 107.16,51.59 109.9,54.34 114.02,54.34 114.24,54.11 114.24,53.76 116.76,51.25 118.02,51.25 | 118.02,51.25 120.07,53.31 120.07,53.99 PR_SMD_2.VIN | v107.39,46.91 107.16,47.02 | 132.93,52.45 127.05,58.34 124.3,58.34 122.7,56.74 122.59,56.74 122.36,56.51 122.36,49.31 120.99,47.94 119.96,47.94 119.73,47.71 119.05,47.71 118.13,48.62 118.13,51.02 118.02,51.25
  Bottom 0.508: v165.79,69.31 v167.85,71.37 167.74,71.6 162.19,77.14 | 162.19,77.14 v160.88,78.45 160.76,78.68 v160.76,86.91 | v107.39,46.91 v109.22,45.08 | v154.25,69.19 162.19,77.14
VCC_5V_1  (via drill 0.61)
  Top 0.508: C11.2 131.62,76.85 131.96,76.85 133.33,75.48 135.28,75.48 142.93,83.14 142.93,90.45 143.96,91.48 143.96,95.37 142.13,97.2 141.91,97.2 JP4.2 142.25,97.43 142.25,115.26 146.25,119.26 146.25,121.89 144.65,123.49 144.65,124.74 142.25,127.14 140.88,127.14 PR_SMD_9.VIN 140.65,127.26 140.65,128.97 141.11,129.43 141.11,130.46 138.25,133.32 137.33,133.32 135.62,131.6 133.22,131.6 | 126.02,138.46 126.02,139.03 124.76,140.29 124.76,141.89 PR_SMD_11.VIN 124.65,142.23 124.65,143.6 122.25,146 119.96,146 119.85,146.12 119.39,146.12 118.7,145.43 118.7,144.52 118.36,144.18 118.36,143.72 118.25,143.6 118.25,143.38 117.9,143.03 116.42,143.03 114.59,144.86 114.59,145.66 PR_SMD_12.VIN 114.36,145.89 114.36,146.46 112.3,148.52 108.42,148.52 107.73,147.83 107.73,145.32 106.07,143.66 | 126.02,138.46 126.02,132.4 R27.2 | 133.22,131.6 133.22,135.26 133.56,135.6 PR_SMD_10.VIN 133.45,135.83 133.45,138.12 130.59,140.98 129.56,140.98 129.22,140.63 129.22,140.52 128.08,139.38 128.08,139.03 127.5,138.46 126.02,138.46 | 133.22,131.6 133.22,131.15 132.53,130.46 132.53,126 R25.2 | 96.13,142.63 93.79,144.98 92.76,144.98 PR_SMD_14.VIN 92.41,145.09 91.61,145.09 90.58,146.12 87.96,146.12 86.36,144.52 85.1,144.52 82.7,142.12 82.7,140.75 PR_SMD_15.VIN 82.58,140.52 80.87,140.52 80.41,140.98 79.38,140.98 76.53,138.12 76.53,137.2 78.24,135.49 78.24,133.66 78.35,133.43 | 96.13,142.63 99.61,139.15 100.41,139.15 R33.2 | 106.07,143.66 103.5,146.23 103.5,146.8 PR_SMD_13.VIN 103.27,146.92 101.67,148.52 97.67,148.52 96.76,147.6 96.76,146.12 97.1,145.78 97.1,144.98 97.21,144.86 97.21,143.72 96.13,142.63
  Top 0.508: 106.07,143.66 106.36,143.38 106.36,143.03 109.44,139.95 109.44,139.15 R31.2 | v78.47,83.6 78.7,83.83 79.95,83.83 IC_2.18 | v75.61,86.45 72.75,86.45 72.53,86.23 71.73,86.23 IC_2.4 | 78.58,100.97 76.41,100.97 D4.C | 78.58,100.97 83.5,96.06 C12.2 83.5,95.71 v83.5,91.37 | 80.3,132.4 79.38,132.4 78.35,133.43 | 80.3,132.4 83.84,132.4 R37.2 | 78.35,133.43 74.24,133.43 PR_SMD_16.VIN | 80.3,127.6 82.7,127.6 89.33,134.23 89.33,134.35 91.73,136.75 R35.2 91.96,136.75 118.13,136.75 R29.2 118.25,136.52 136.65,118.12 136.88,118.12 R23.2 | 80.3,127.6 78.81,129.09 78.81,129.77 80.3,131.26 80.3,132.4 | 78.58,100.97 78.7,101.2 78.7,125.89 80.18,127.37 80.3,127.6
  Bottom 0.508: v75.61,86.45 76.81,85.25 | 76.81,85.25 v78.47,83.6 | 76.81,85.25 78.47,86.91 79.04,86.91 v83.5,91.37
VCC_5V_2  (via drill 0.61)
  Top 0.508: C18.2 26.23,90.8 26.23,91.14 24.86,92.51 24.86,94.57 31.83,101.54 34.01,101.54 35.03,102.57 35.72,102.57 44.98,111.83 44.98,112.63 R43.2 45.09,112.97 45.09,121.32 49.09,125.32 49.09,127.95 R41.2 49.32,128.17 49.32,129.43 | 49.32,129.43 49.32,133.89 56.98,141.55 R39.2 | v54.24,130 58.24,130 PR_SMD_17.VIN | 49.32,129.43 v52.18,129.43 | 72.18,56.85 68.3,56.85 R51.2 | 72.18,56.85 75.38,53.65 75.95,53.65 76.3,53.31 76.64,53.31 76.75,53.42 76.87,53.42 77.15,53.71 | 77.15,53.71 79.73,56.28 79.73,58.11 PR_SMD_23.VIN | 77.15,53.71 81.78,49.08 R53.2 82.01,48.85 82.81,48.05 84.64,48.05 | 72.18,56.85 72.3,57.08 75.61,60.39 75.61,62.79 72.18,66.22 68.64,66.22 PR_SMD_22.VIN 68.41,66.11 67.61,66.11 66.92,65.42 v65.21,65.42 | 84.64,48.05 89.44,48.05 89.78,47.71 90.93,47.71 92.64,49.42 92.64,53.19 PR_SMD_24.VIN | 84.64,48.05 84.64,38.91 JP5.2 | 48.92,100.91 51.27,103.26 51.95,103.26 PR_SMD_19.VIN | 48.92,100.91 45.09,97.08 R45.2 45.09,96.74 45.09,93.08 47.95,90.23 47.95,89.2 48.29,88.85 48.29,88.51 50.64,86.17 | 48.92,100.91 46.12,103.71 46.12,106 47.72,107.6 52.18,107.6 54.47,109.89 54.47,113.89 53.44,114.91 53.44,117.09 PR_SMD_18.VIN 53.32,117.32 52.29,118.34 v52.29,118.92 | 50.64,86.17 54.12,89.65 PR_SMD_20.VIN | 50.64,86.17 49.21,84.74 49.21,81.77 R47.2 49.09,81.54 49.09,78.91 43.95,73.77 43.95,73.08 IC_3.4 43.95,72.74 43.95,70.45 44.18,70.22 v44.18,68.05 | C17.2 33.89,90.68 34.23,90.34 40.18,90.34 D6.C 40.41,90.11 v44.06,90.11 | v42.81,66.68 41.55,65.42 41.55,64.51 IC_3.18 | v51.95,68.17 56.98,68.17 R49.2 | v59.72,73.31 59.72,76.97 PR_SMD_21.VIN
  Bottom 0.508: v54.24,130 52.75,130 v52.18,129.43 52.29,129.2 v52.29,118.92 | v42.81,66.68 v44.18,68.05 44.41,68.17 46.46,68.17 | 46.46,68.17 v51.95,68.17 52.18,68.28 54.47,68.28 | v59.72,73.31 59.72,72.97 55.04,68.28 54.47,68.28 | v44.06,90.11 44.06,89.77 46.46,87.37 46.46,68.17 | v65.21,65.42 55.95,65.42 54.47,66.91 54.47,68.28
XTAL1_IC_1
  Top 0.305: 168.31,62.57 168.31,56.28 167.39,55.36 C2.2 | 168.31,62.57 168.31,64.39 IC_1.7 | 168.31,62.57 162.94,62.57 162.71,62.79 158.94,62.79 Q1.3
XTAL1_IC_2
  Top 0.305: IC_2.7 71.61,83.71 70.81,83.71 70.58,83.48 70.58,79.82 76.07,74.34 80.98,74.34 86.01,79.37 C8.2 86.13,79.6 86.7,80.17 86.7,85.08 86.47,85.31 86.13,85.31 83.84,87.6 83.61,87.6 Q2.3
XTAL1_IC_3
  Top 0.305: 41.66,77.88 41.66,72.85 IC_3.7 | 41.66,77.88 43.84,80.05 Q3.3 | C14.2 35.15,83.37 36.06,83.37 41.55,77.88 41.66,77.88
XTAL2_IC_1
  Top 0.305: IC_1.8 169.11,64.39 169.11,54.91 168.19,53.99 160.99,53.99 159.74,55.25 C1.2 159.74,55.48 155.28,59.94 155.28,60.51 Q1.1
XTAL2_IC_2
  Top 0.305: IC_2.8 71.73,82.91 71.73,80.85 76.87,75.71 C7.2 76.3,76.4 81.44,81.54 83.04,81.54 85.44,83.94 85.78,83.94 Q2.1
XTAL2_IC_3
  Top 0.305: 30.41,81.83 28.86,83.37 C13.2 | 30.41,81.83 39.38,72.85 40.75,72.85 IC_3.8 | 30.41,81.83 33.09,84.51 36.18,84.51 36.75,83.94 41.55,83.94 Q3.1

### Text on the board
tNames: Black Panther | Doctor Strange | Ant Man
tValues: - | + | + | -